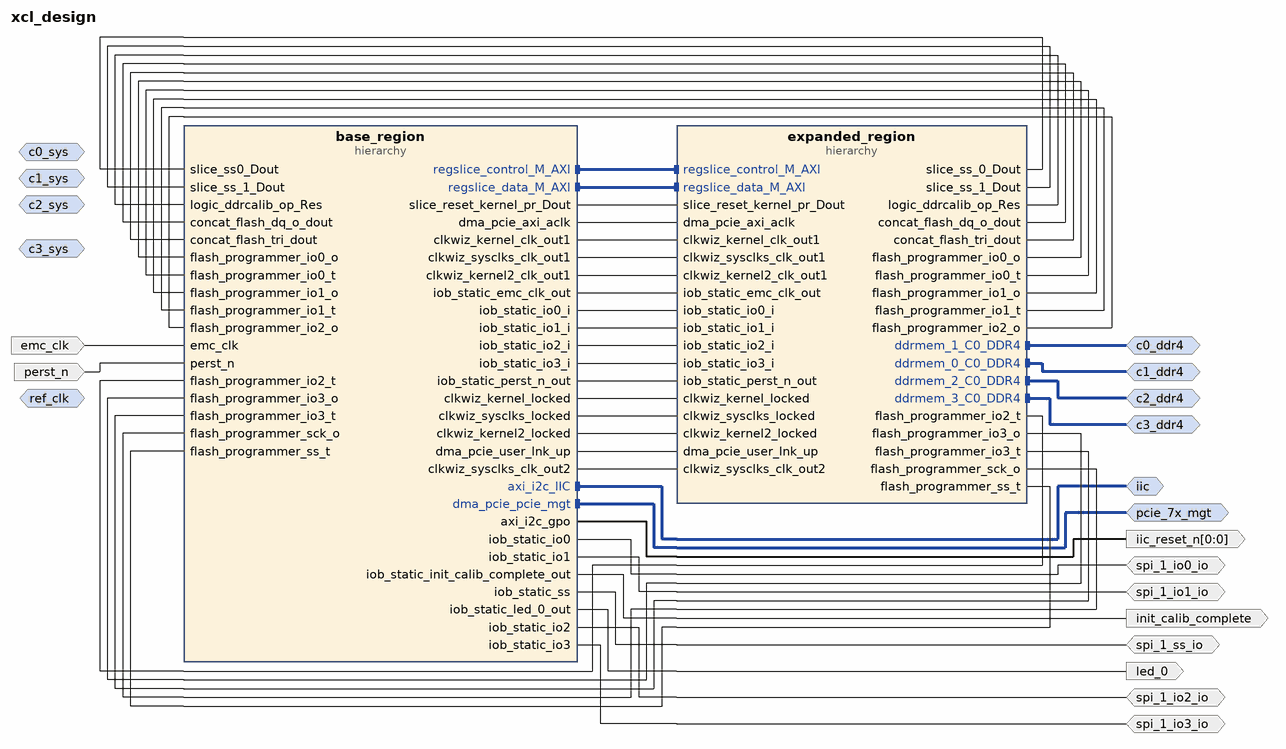
[diagram p0: block diagram of the top level]
# Vivado block design xcl_design, xcku115-flvb2104-2-e, Vivado 2017.1
create_bd_design xcl_design

create_bd_intf_port -mode Master -vlnv xilinx.com:interface:ddr4_rtl:1.0 c0_ddr4
create_bd_intf_port -mode Master -vlnv xilinx.com:interface:ddr4_rtl:1.0 c1_ddr4
create_bd_intf_port -mode Master -vlnv xilinx.com:interface:ddr4_rtl:1.0 c2_ddr4
create_bd_intf_port -mode Master -vlnv xilinx.com:interface:ddr4_rtl:1.0 c3_ddr4
create_bd_intf_port -mode Master -vlnv xilinx.com:interface:iic_rtl:1.0 iic
create_bd_intf_port -mode Master -vlnv xilinx.com:interface:pcie_7x_mgt_rtl:1.0 pcie_7x_mgt
create_bd_intf_port -mode Slave -vlnv xilinx.com:interface:diff_clock_rtl:1.0 c0_sys
set_property -dict {CONFIG.FREQ_HZ 300000000} [get_bd_intf_ports c0_sys]
create_bd_intf_port -mode Slave -vlnv xilinx.com:interface:diff_clock_rtl:1.0 c1_sys
set_property -dict {CONFIG.FREQ_HZ 300000000} [get_bd_intf_ports c1_sys]
create_bd_intf_port -mode Slave -vlnv xilinx.com:interface:diff_clock_rtl:1.0 c2_sys
set_property -dict {CONFIG.FREQ_HZ 300000000} [get_bd_intf_ports c2_sys]
create_bd_intf_port -mode Slave -vlnv xilinx.com:interface:diff_clock_rtl:1.0 c3_sys
set_property -dict {CONFIG.FREQ_HZ 300000000} [get_bd_intf_ports c3_sys]
create_bd_intf_port -mode Slave -vlnv xilinx.com:interface:diff_clock_rtl:1.0 ref_clk
set_property -dict {CONFIG.FREQ_HZ 100000000} [get_bd_intf_ports ref_clk]
create_bd_port -dir IO spi_1_ss_io
create_bd_port -dir IO spi_1_io0_io
create_bd_port -dir IO spi_1_io1_io
create_bd_port -dir IO spi_1_io2_io
create_bd_port -dir IO spi_1_io3_io
create_bd_port -dir O -from 0 -to 0 iic_reset_n
create_bd_port -dir O init_calib_complete
create_bd_port -dir O led_0
create_bd_port -dir I -type clk emc_clk
set_property -dict {CONFIG.FREQ_HZ 90000000} [get_bd_ports emc_clk]
create_bd_port -dir I -type rst perst_n
set_property -dict {CONFIG.POLARITY ACTIVE_LOW} [get_bd_ports perst_n]

create_bd_cell -type hier base_region
create_bd_cell -type hier expanded_region

# ---- hierarchy /base_region ----
current_bd_instance /base_region
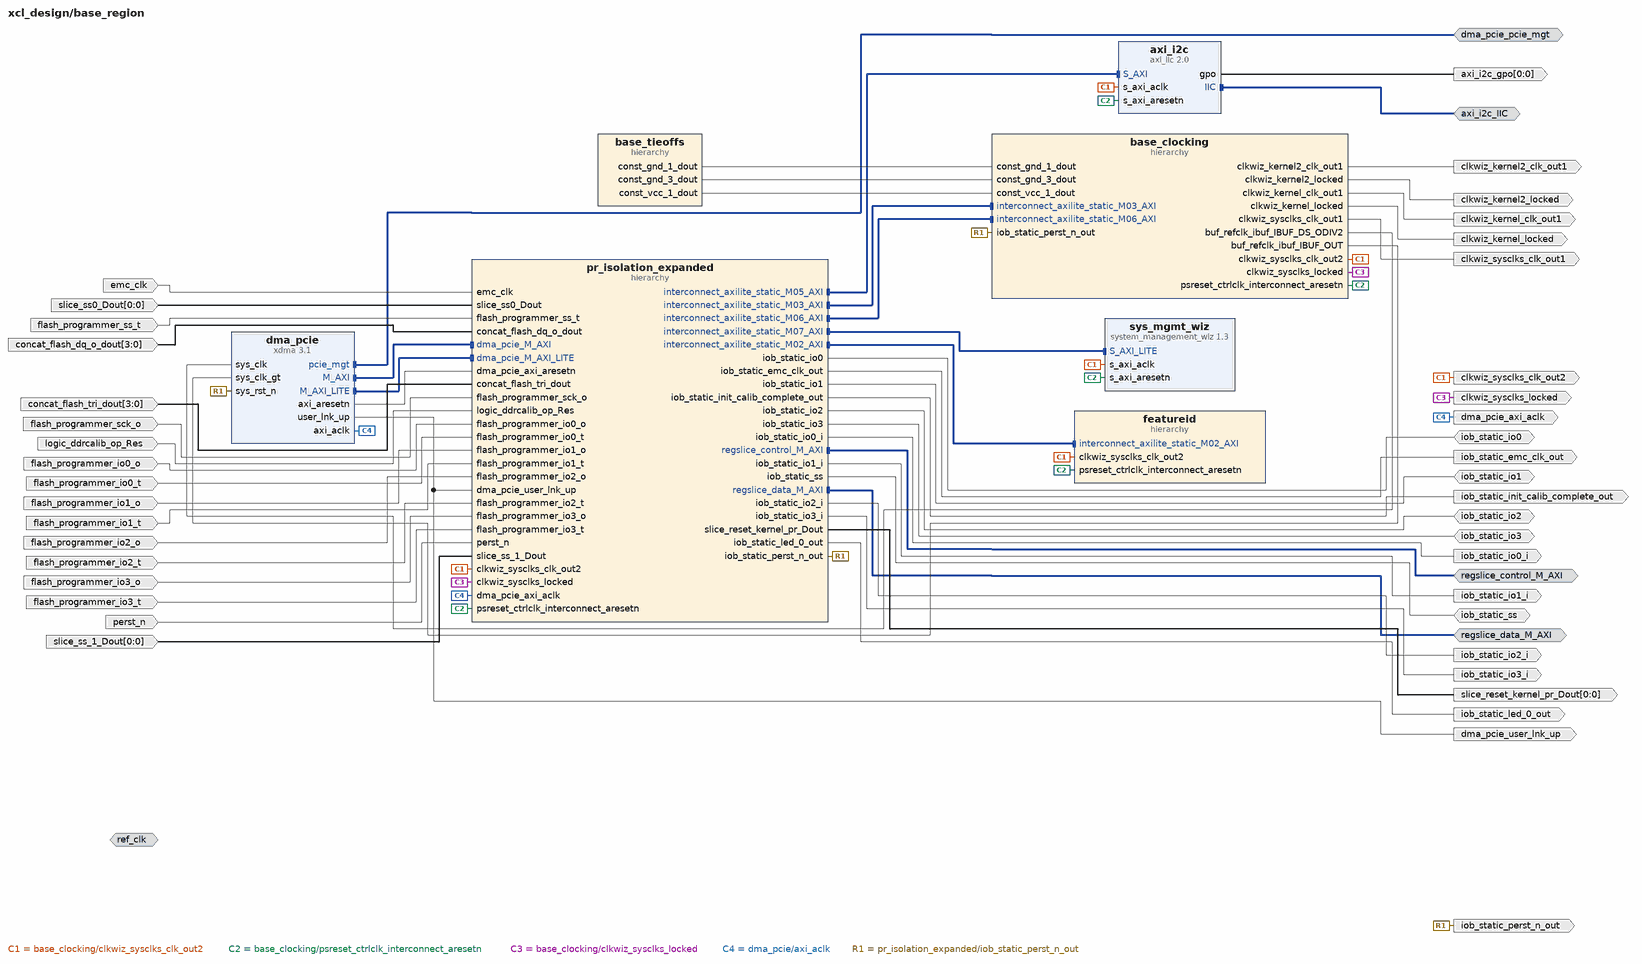
[diagram p1: block diagram inside /base_region]
create_bd_intf_pin -mode Master -vlnv xilinx.com:interface:iic_rtl:1.0 axi_i2c_IIC
create_bd_intf_pin -mode Master -vlnv xilinx.com:interface:pcie_7x_mgt_rtl:1.0 dma_pcie_pcie_mgt
create_bd_intf_pin -mode Slave -vlnv xilinx.com:interface:diff_clock_rtl:1.0 ref_clk
create_bd_intf_pin -mode Master -vlnv xilinx.com:interface:aximm_rtl:1.0 regslice_control_M_AXI
create_bd_intf_pin -mode Master -vlnv xilinx.com:interface:aximm_rtl:1.0 regslice_data_M_AXI
create_bd_pin -dir O -from 0 -to 0 axi_i2c_gpo
create_bd_pin -dir O -type clk clkwiz_kernel2_clk_out1
create_bd_pin -dir O clkwiz_kernel2_locked
create_bd_pin -dir O -type clk clkwiz_kernel_clk_out1
create_bd_pin -dir O clkwiz_kernel_locked
create_bd_pin -dir O -type clk clkwiz_sysclks_clk_out1
create_bd_pin -dir O -type clk clkwiz_sysclks_clk_out2
create_bd_pin -dir O clkwiz_sysclks_locked
create_bd_pin -dir I -from 3 -to 0 concat_flash_dq_o_dout
create_bd_pin -dir I -from 3 -to 0 concat_flash_tri_dout
create_bd_pin -dir O -type clk dma_pcie_axi_aclk
create_bd_pin -dir O dma_pcie_user_lnk_up
create_bd_pin -dir I emc_clk
create_bd_pin -dir I flash_programmer_io0_o
create_bd_pin -dir I flash_programmer_io0_t
create_bd_pin -dir I flash_programmer_io1_o
create_bd_pin -dir I flash_programmer_io1_t
create_bd_pin -dir I flash_programmer_io2_o
create_bd_pin -dir I flash_programmer_io2_t
create_bd_pin -dir I flash_programmer_io3_o
create_bd_pin -dir I flash_programmer_io3_t
create_bd_pin -dir I -type clk flash_programmer_sck_o
create_bd_pin -dir I flash_programmer_ss_t
create_bd_pin -dir O iob_static_emc_clk_out
create_bd_pin -dir O iob_static_init_calib_complete_out
create_bd_pin -dir IO iob_static_io0
create_bd_pin -dir O iob_static_io0_i
create_bd_pin -dir IO iob_static_io1
create_bd_pin -dir O iob_static_io1_i
create_bd_pin -dir IO iob_static_io2
create_bd_pin -dir O iob_static_io2_i
create_bd_pin -dir IO iob_static_io3
create_bd_pin -dir O iob_static_io3_i
create_bd_pin -dir O iob_static_led_0_out
create_bd_pin -dir O iob_static_perst_n_out
create_bd_pin -dir IO iob_static_ss
create_bd_pin -dir I logic_ddrcalib_op_Res
create_bd_pin -dir I perst_n
create_bd_pin -dir O -from 0 -to 0 slice_reset_kernel_pr_Dout
create_bd_pin -dir I -from 0 -to 0 slice_ss0_Dout
create_bd_pin -dir I -from 0 -to 0 slice_ss_1_Dout

create_bd_cell -type ip -vlnv xilinx.com:ip:axi_iic:2.0 axi_i2c
set_property -dict {CONFIG.C_DEFAULT_VALUE 0x01} [get_bd_cells axi_i2c]
create_bd_cell -type hier base_clocking
create_bd_cell -type hier base_tieoffs
create_bd_cell -type ip -vlnv xilinx.com:ip:xdma:3.1 dma_pcie
set_property -dict [list \
  CONFIG.mode_selection Advanced \
  CONFIG.pl_link_cap_max_link_width X8 \
  CONFIG.pl_link_cap_max_link_speed 8.0_GT/s \
  CONFIG.axi_data_width 256_bit \
  CONFIG.axisten_freq 250 \
  CONFIG.mcap_enablement PR_over_PCIe \
  CONFIG.pf0_device_id 8238 \
  CONFIG.pf0_subsystem_id 4432 \
  CONFIG.axilite_master_en true \
  CONFIG.axilite_master_size 4 \
  CONFIG.xdma_rnum_chnl 2 \
  CONFIG.xdma_wnum_chnl 2 \
  CONFIG.xdma_num_usr_irq 16 \
  CONFIG.cfg_mgmt_if false \
  CONFIG.axi_id_width 2 \
] [get_bd_cells dma_pcie]
create_bd_cell -type hier featureid
create_bd_cell -type hier pr_isolation_expanded
create_bd_cell -type ip -vlnv xilinx.com:ip:system_management_wiz:1.3 sys_mgmt_wiz
set_property -dict [list \
  CONFIG.DCLK_FREQUENCY 50 \
  CONFIG.OT_ALARM false \
  CONFIG.USER_TEMP_ALARM false \
  CONFIG.VCCINT_ALARM false \
  CONFIG.VCCAUX_ALARM false \
  CONFIG.CHANNEL_ENABLE_VP_VN false \
  CONFIG.AVERAGE_ENABLE_VBRAM true \
  CONFIG.AVERAGE_ENABLE_TEMPERATURE true \
  CONFIG.AVERAGE_ENABLE_VCCINT true \
  CONFIG.AVERAGE_ENABLE_VCCAUX true \
] [get_bd_cells sys_mgmt_wiz]

# ---- hierarchy /base_region/base_clocking ----
current_bd_instance /base_region/base_clocking
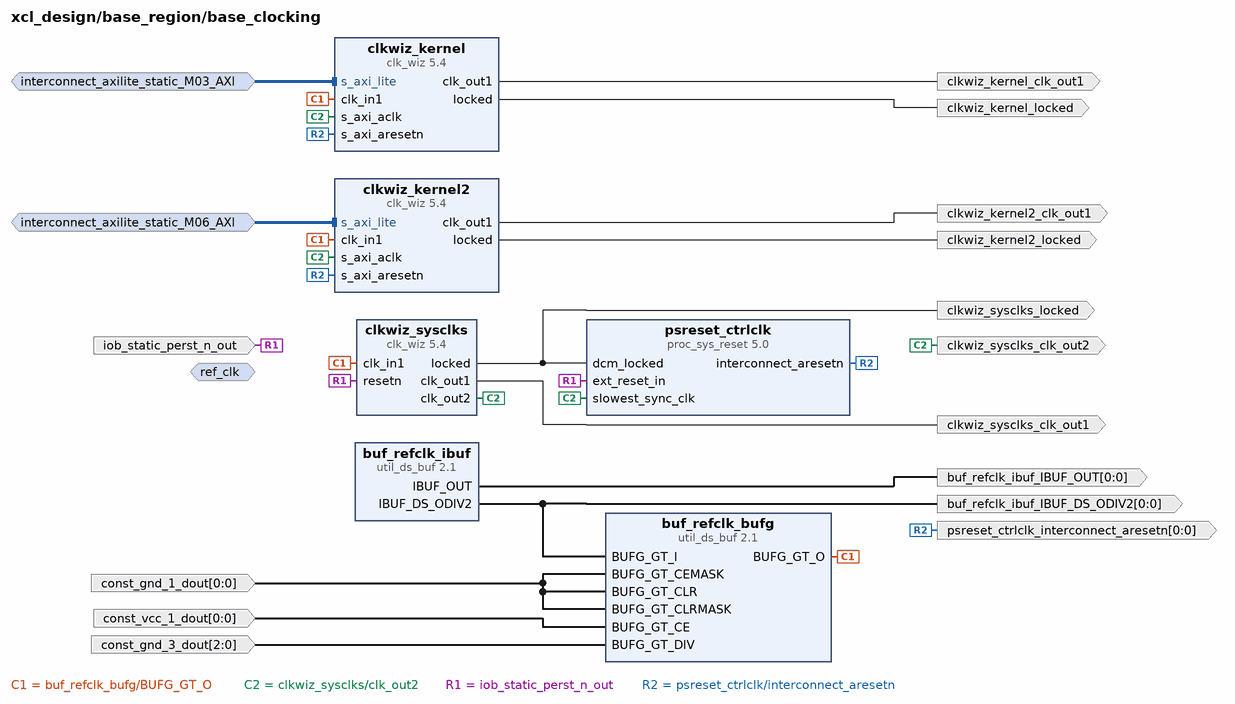
[diagram p2: block diagram inside /base_region/base_clocking]
create_bd_intf_pin -mode Slave -vlnv xilinx.com:interface:aximm_rtl:1.0 interconnect_axilite_static_M03_AXI
create_bd_intf_pin -mode Slave -vlnv xilinx.com:interface:aximm_rtl:1.0 interconnect_axilite_static_M06_AXI
create_bd_intf_pin -mode Slave -vlnv xilinx.com:interface:diff_clock_rtl:1.0 ref_clk
create_bd_pin -dir O -from 0 -to 0 -type clk buf_refclk_ibuf_IBUF_DS_ODIV2
create_bd_pin -dir O -from 0 -to 0 -type clk buf_refclk_ibuf_IBUF_OUT
create_bd_pin -dir O -type clk clkwiz_kernel2_clk_out1
create_bd_pin -dir O clkwiz_kernel2_locked
create_bd_pin -dir O -type clk clkwiz_kernel_clk_out1
create_bd_pin -dir O clkwiz_kernel_locked
create_bd_pin -dir O -type clk clkwiz_sysclks_clk_out1
create_bd_pin -dir O -type clk clkwiz_sysclks_clk_out2
create_bd_pin -dir O clkwiz_sysclks_locked
create_bd_pin -dir I -from 0 -to 0 const_gnd_1_dout
create_bd_pin -dir I -from 2 -to 0 const_gnd_3_dout
create_bd_pin -dir I -from 0 -to 0 const_vcc_1_dout
create_bd_pin -dir I -type rst iob_static_perst_n_out
create_bd_pin -dir O -from 0 -to 0 -type rst psreset_ctrlclk_interconnect_aresetn

create_bd_cell -type ip -vlnv xilinx.com:ip:util_ds_buf:2.1 buf_refclk_bufg
set_property -dict {CONFIG.C_BUF_TYPE BUFG_GT} [get_bd_cells buf_refclk_bufg]
create_bd_cell -type ip -vlnv xilinx.com:ip:util_ds_buf:2.1 buf_refclk_ibuf
set_property -dict {CONFIG.C_BUF_TYPE IBUFDSGTE} [get_bd_cells buf_refclk_ibuf]
create_bd_cell -type ip -vlnv xilinx.com:ip:clk_wiz:5.4 clkwiz_kernel
set_property -dict {CONFIG.USE_DYN_RECONFIG true CONFIG.CLKOUT1_REQUESTED_OUT_FREQ 300.000} [get_bd_cells clkwiz_kernel]
create_bd_cell -type ip -vlnv xilinx.com:ip:clk_wiz:5.4 clkwiz_kernel2
set_property -dict [list \
  CONFIG.USE_DYN_RECONFIG true \
  CONFIG.CLKOUT1_REQUESTED_OUT_FREQ 500.000 \
  CONFIG.MMCM_DIVCLK_DIVIDE 1 \
  CONFIG.MMCM_CLKOUT0_DIVIDE_F 2.000 \
  CONFIG.CLKOUT1_JITTER 97.082 \
] [get_bd_cells clkwiz_kernel2]
create_bd_cell -type ip -vlnv xilinx.com:ip:clk_wiz:5.4 clkwiz_sysclks
set_property -dict [list \
  CONFIG.PRIMITIVE PLL \
  CONFIG.USE_PHASE_ALIGNMENT false \
  CONFIG.SECONDARY_SOURCE Single_ended_clock_capable_pin \
  CONFIG.CLKOUT2_USED true \
  CONFIG.NUM_OUT_CLKS 2 \
  CONFIG.CLKOUT1_REQUESTED_OUT_FREQ 300.000 \
  CONFIG.CLKOUT2_REQUESTED_OUT_FREQ 50.000 \
  CONFIG.PRIM_SOURCE Single_ended_clock_capable_pin \
  CONFIG.CLKOUT1_DRIVES Buffer \
  CONFIG.CLKOUT2_DRIVES Buffer \
  CONFIG.CLKOUT3_DRIVES Buffer \
  CONFIG.CLKOUT4_DRIVES Buffer \
  CONFIG.CLKOUT5_DRIVES Buffer \
  CONFIG.CLKOUT6_DRIVES Buffer \
  CONFIG.CLKOUT7_DRIVES Buffer \
  CONFIG.RESET_PORT resetn \
  CONFIG.MMCM_DIVCLK_DIVIDE 1 \
  CONFIG.MMCM_CLKFBOUT_MULT_F 6 \
  CONFIG.MMCM_COMPENSATION AUTO \
  CONFIG.MMCM_CLKOUT0_DIVIDE_F 2 \
  CONFIG.MMCM_CLKOUT1_DIVIDE 12 \
  CONFIG.RESET_TYPE ACTIVE_LOW \
  CONFIG.CLKOUT1_JITTER 122.522 \
  CONFIG.CLKOUT1_PHASE_ERROR 132.063 \
  CONFIG.CLKOUT2_JITTER 174.353 \
  CONFIG.CLKOUT2_PHASE_ERROR 132.063 \
] [get_bd_cells clkwiz_sysclks]
create_bd_cell -type ip -vlnv xilinx.com:ip:proc_sys_reset:5.0 psreset_ctrlclk
set_property -dict {CONFIG.C_AUX_RST_WIDTH 1 CONFIG.C_EXT_RST_WIDTH 1} [get_bd_cells psreset_ctrlclk]

# ---- hierarchy /base_region/base_tieoffs ----
current_bd_instance /base_region/base_tieoffs
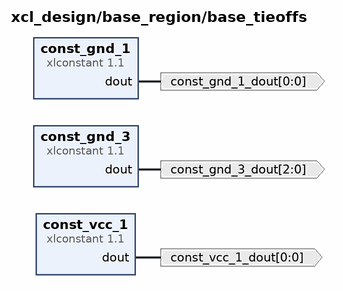
[diagram p3: block diagram inside /base_region/base_tieoffs]
create_bd_pin -dir O -from 0 -to 0 const_gnd_1_dout
create_bd_pin -dir O -from 2 -to 0 const_gnd_3_dout
create_bd_pin -dir O -from 0 -to 0 const_vcc_1_dout

create_bd_cell -type ip -vlnv xilinx.com:ip:xlconstant:1.1 const_gnd_1
set_property -dict {CONFIG.CONST_VAL 0} [get_bd_cells const_gnd_1]
create_bd_cell -type ip -vlnv xilinx.com:ip:xlconstant:1.1 const_gnd_3
set_property -dict {CONFIG.CONST_WIDTH 3 CONFIG.CONST_VAL 0} [get_bd_cells const_gnd_3]
create_bd_cell -type ip -vlnv xilinx.com:ip:xlconstant:1.1 const_vcc_1

# ---- hierarchy /base_region/featureid ----
current_bd_instance /base_region/featureid
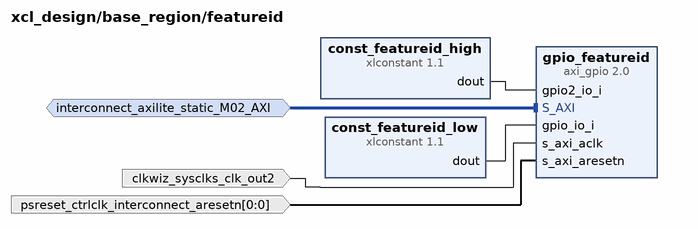
[diagram p4: block diagram inside /base_region/featureid]
create_bd_intf_pin -mode Slave -vlnv xilinx.com:interface:aximm_rtl:1.0 interconnect_axilite_static_M02_AXI
create_bd_pin -dir I -type clk clkwiz_sysclks_clk_out2
create_bd_pin -dir I -from 0 -to 0 -type rst psreset_ctrlclk_interconnect_aresetn

create_bd_cell -type ip -vlnv xilinx.com:ip:xlconstant:1.1 const_featureid_high
set_property -dict {CONFIG.CONST_WIDTH 32 CONFIG.CONST_VAL 0} [get_bd_cells const_featureid_high]
create_bd_cell -type ip -vlnv xilinx.com:ip:xlconstant:1.1 const_featureid_low
set_property -dict {CONFIG.CONST_WIDTH 32 CONFIG.CONST_VAL 0} [get_bd_cells const_featureid_low]
create_bd_cell -type ip -vlnv xilinx.com:ip:axi_gpio:2.0 gpio_featureid
set_property -dict {CONFIG.C_IS_DUAL 1 CONFIG.C_ALL_INPUTS 1 CONFIG.C_ALL_INPUTS_2 1} [get_bd_cells gpio_featureid]

# ---- hierarchy /base_region/pr_isolation_expanded ----
current_bd_instance /base_region/pr_isolation_expanded
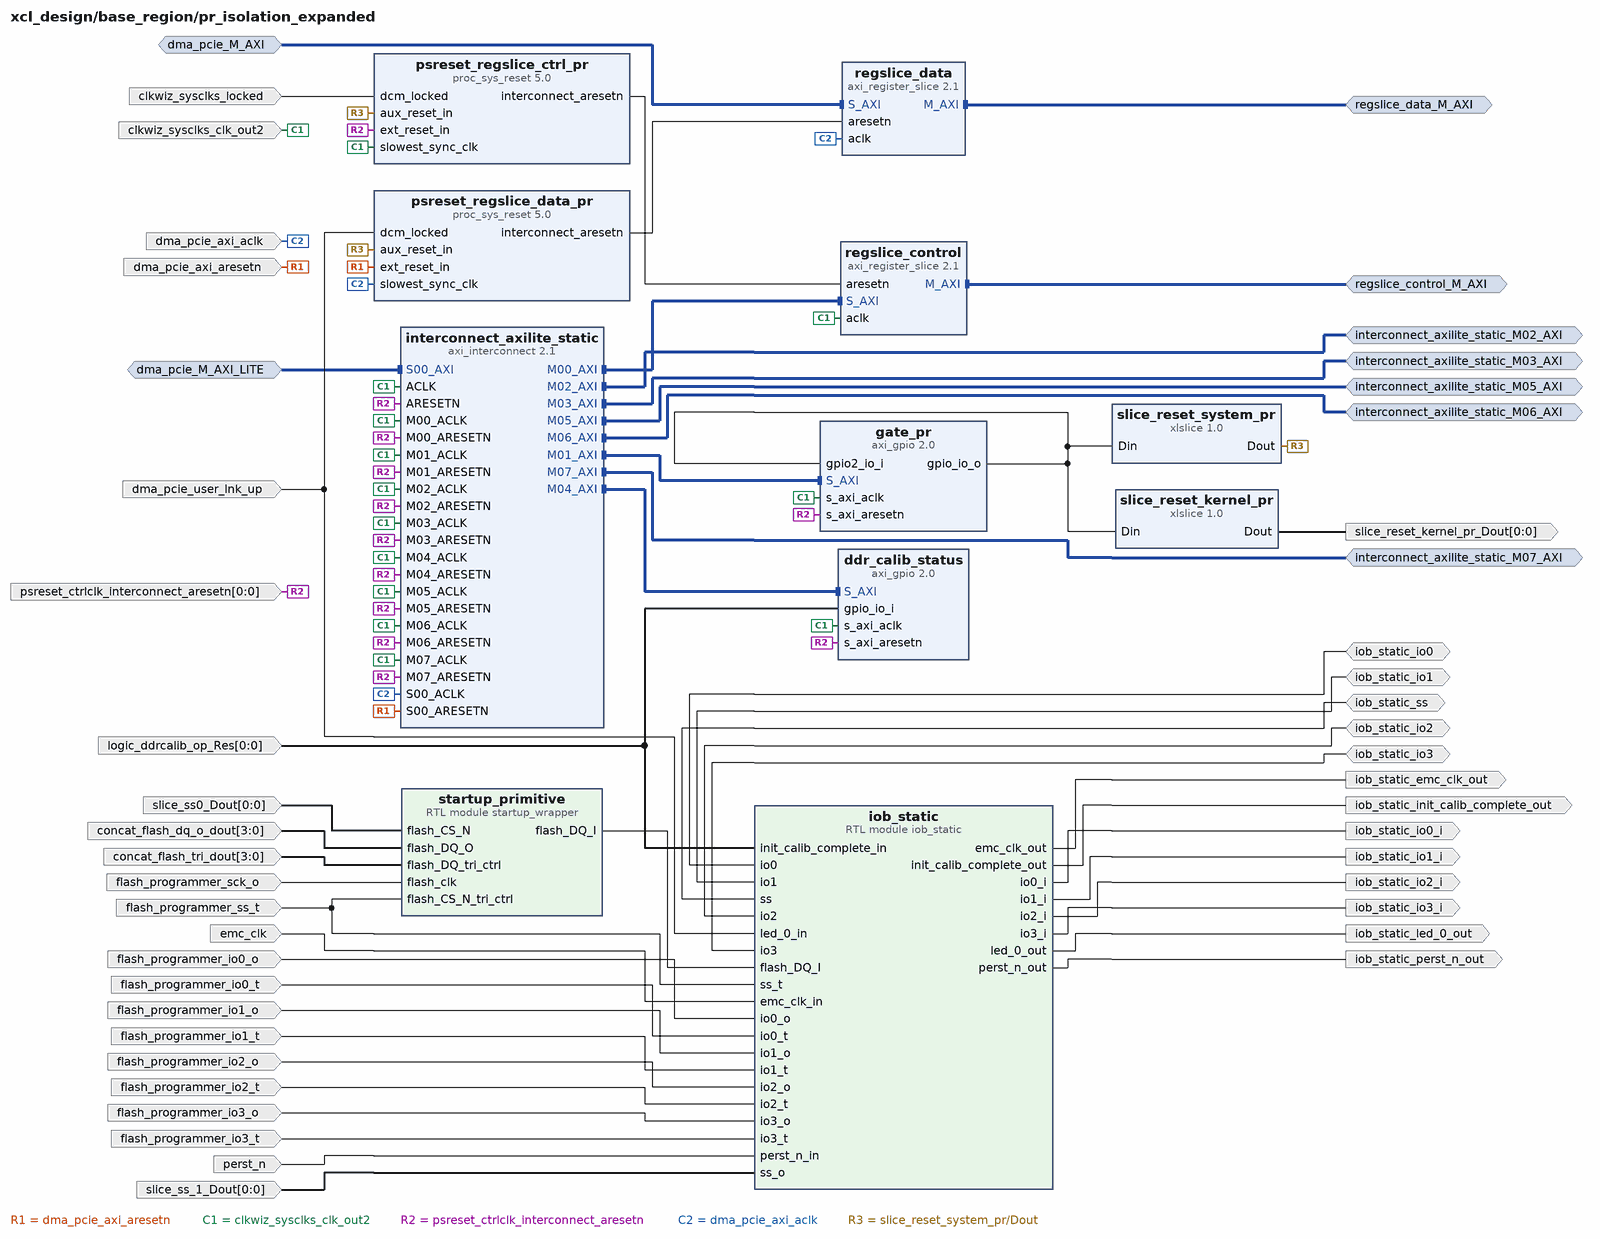
[diagram p5: block diagram inside /base_region/pr_isolation_expanded]
create_bd_intf_pin -mode Slave -vlnv xilinx.com:interface:aximm_rtl:1.0 dma_pcie_M_AXI
create_bd_intf_pin -mode Slave -vlnv xilinx.com:interface:aximm_rtl:1.0 dma_pcie_M_AXI_LITE
create_bd_intf_pin -mode Master -vlnv xilinx.com:interface:aximm_rtl:1.0 interconnect_axilite_static_M02_AXI
create_bd_intf_pin -mode Master -vlnv xilinx.com:interface:aximm_rtl:1.0 interconnect_axilite_static_M03_AXI
create_bd_intf_pin -mode Master -vlnv xilinx.com:interface:aximm_rtl:1.0 interconnect_axilite_static_M05_AXI
create_bd_intf_pin -mode Master -vlnv xilinx.com:interface:aximm_rtl:1.0 interconnect_axilite_static_M06_AXI
create_bd_intf_pin -mode Master -vlnv xilinx.com:interface:aximm_rtl:1.0 interconnect_axilite_static_M07_AXI
create_bd_intf_pin -mode Master -vlnv xilinx.com:interface:aximm_rtl:1.0 regslice_control_M_AXI
create_bd_intf_pin -mode Master -vlnv xilinx.com:interface:aximm_rtl:1.0 regslice_data_M_AXI
create_bd_pin -dir I -type clk clkwiz_sysclks_clk_out2
create_bd_pin -dir I clkwiz_sysclks_locked
create_bd_pin -dir I -from 3 -to 0 concat_flash_dq_o_dout
create_bd_pin -dir I -from 3 -to 0 concat_flash_tri_dout
create_bd_pin -dir I -type clk dma_pcie_axi_aclk
create_bd_pin -dir I -type rst dma_pcie_axi_aresetn
create_bd_pin -dir I dma_pcie_user_lnk_up
create_bd_pin -dir I emc_clk
create_bd_pin -dir I flash_programmer_io0_o
create_bd_pin -dir I flash_programmer_io0_t
create_bd_pin -dir I flash_programmer_io1_o
create_bd_pin -dir I flash_programmer_io1_t
create_bd_pin -dir I flash_programmer_io2_o
create_bd_pin -dir I flash_programmer_io2_t
create_bd_pin -dir I flash_programmer_io3_o
create_bd_pin -dir I flash_programmer_io3_t
create_bd_pin -dir I -type clk flash_programmer_sck_o
create_bd_pin -dir I flash_programmer_ss_t
create_bd_pin -dir O iob_static_emc_clk_out
create_bd_pin -dir O iob_static_init_calib_complete_out
create_bd_pin -dir IO iob_static_io0
create_bd_pin -dir O iob_static_io0_i
create_bd_pin -dir IO iob_static_io1
create_bd_pin -dir O iob_static_io1_i
create_bd_pin -dir IO iob_static_io2
create_bd_pin -dir O iob_static_io2_i
create_bd_pin -dir IO iob_static_io3
create_bd_pin -dir O iob_static_io3_i
create_bd_pin -dir O iob_static_led_0_out
create_bd_pin -dir O iob_static_perst_n_out
create_bd_pin -dir IO iob_static_ss
create_bd_pin -dir I -from 0 -to 0 logic_ddrcalib_op_Res
create_bd_pin -dir I perst_n
create_bd_pin -dir I -from 0 -to 0 -type rst psreset_ctrlclk_interconnect_aresetn
create_bd_pin -dir O -from 0 -to 0 slice_reset_kernel_pr_Dout
create_bd_pin -dir I -from 0 -to 0 slice_ss0_Dout
create_bd_pin -dir I -from 0 -to 0 slice_ss_1_Dout

create_bd_cell -type ip -vlnv xilinx.com:ip:axi_gpio:2.0 ddr_calib_status
set_property -dict {CONFIG.C_GPIO_WIDTH 1 CONFIG.C_ALL_INPUTS 1} [get_bd_cells ddr_calib_status]
create_bd_cell -type ip -vlnv xilinx.com:ip:axi_gpio:2.0 gate_pr
set_property -dict [list \
  CONFIG.C_GPIO_WIDTH 2 \
  CONFIG.C_GPIO2_WIDTH 2 \
  CONFIG.C_IS_DUAL 1 \
  CONFIG.C_DOUT_DEFAULT 0xFFFFFFFF \
  CONFIG.C_ALL_INPUTS_2 1 \
  CONFIG.C_ALL_OUTPUTS 1 \
] [get_bd_cells gate_pr]
create_bd_cell -type ip -vlnv xilinx.com:ip:axi_interconnect:2.1 interconnect_axilite_static
set_property -dict {CONFIG.NUM_MI 8 CONFIG.S00_HAS_REGSLICE 4} [get_bd_cells interconnect_axilite_static]
create_bd_cell -type module -reference iob_static iob_static
create_bd_cell -type ip -vlnv xilinx.com:ip:proc_sys_reset:5.0 psreset_regslice_ctrl_pr
set_property -dict {CONFIG.C_AUX_RST_WIDTH 1 CONFIG.C_EXT_RST_WIDTH 1} [get_bd_cells psreset_regslice_ctrl_pr]
create_bd_cell -type ip -vlnv xilinx.com:ip:proc_sys_reset:5.0 psreset_regslice_data_pr
set_property -dict {CONFIG.C_AUX_RST_WIDTH 1 CONFIG.C_EXT_RST_WIDTH 1} [get_bd_cells psreset_regslice_data_pr]
create_bd_cell -type ip -vlnv xilinx.com:ip:axi_register_slice:2.1 regslice_control
create_bd_cell -type ip -vlnv xilinx.com:ip:axi_register_slice:2.1 regslice_data
set_property -dict [list \
  CONFIG.PROTOCOL AXI4 \
  CONFIG.READ_WRITE_MODE READ_WRITE \
  CONFIG.ADDR_WIDTH 38 \
  CONFIG.DATA_WIDTH 256 \
  CONFIG.ID_WIDTH 4 \
] [get_bd_cells regslice_data]
create_bd_cell -type ip -vlnv xilinx.com:ip:xlslice:1.0 slice_reset_kernel_pr
set_property -dict {CONFIG.DIN_TO 1 CONFIG.DIN_FROM 1 CONFIG.DIN_WIDTH 2} [get_bd_cells slice_reset_kernel_pr]
create_bd_cell -type ip -vlnv xilinx.com:ip:xlslice:1.0 slice_reset_system_pr
set_property -dict {CONFIG.DIN_TO 0 CONFIG.DIN_FROM 0 CONFIG.DIN_WIDTH 2} [get_bd_cells slice_reset_system_pr]
create_bd_cell -type module -reference startup_wrapper startup_primitive

# ---- hierarchy /expanded_region ----
current_bd_instance /expanded_region
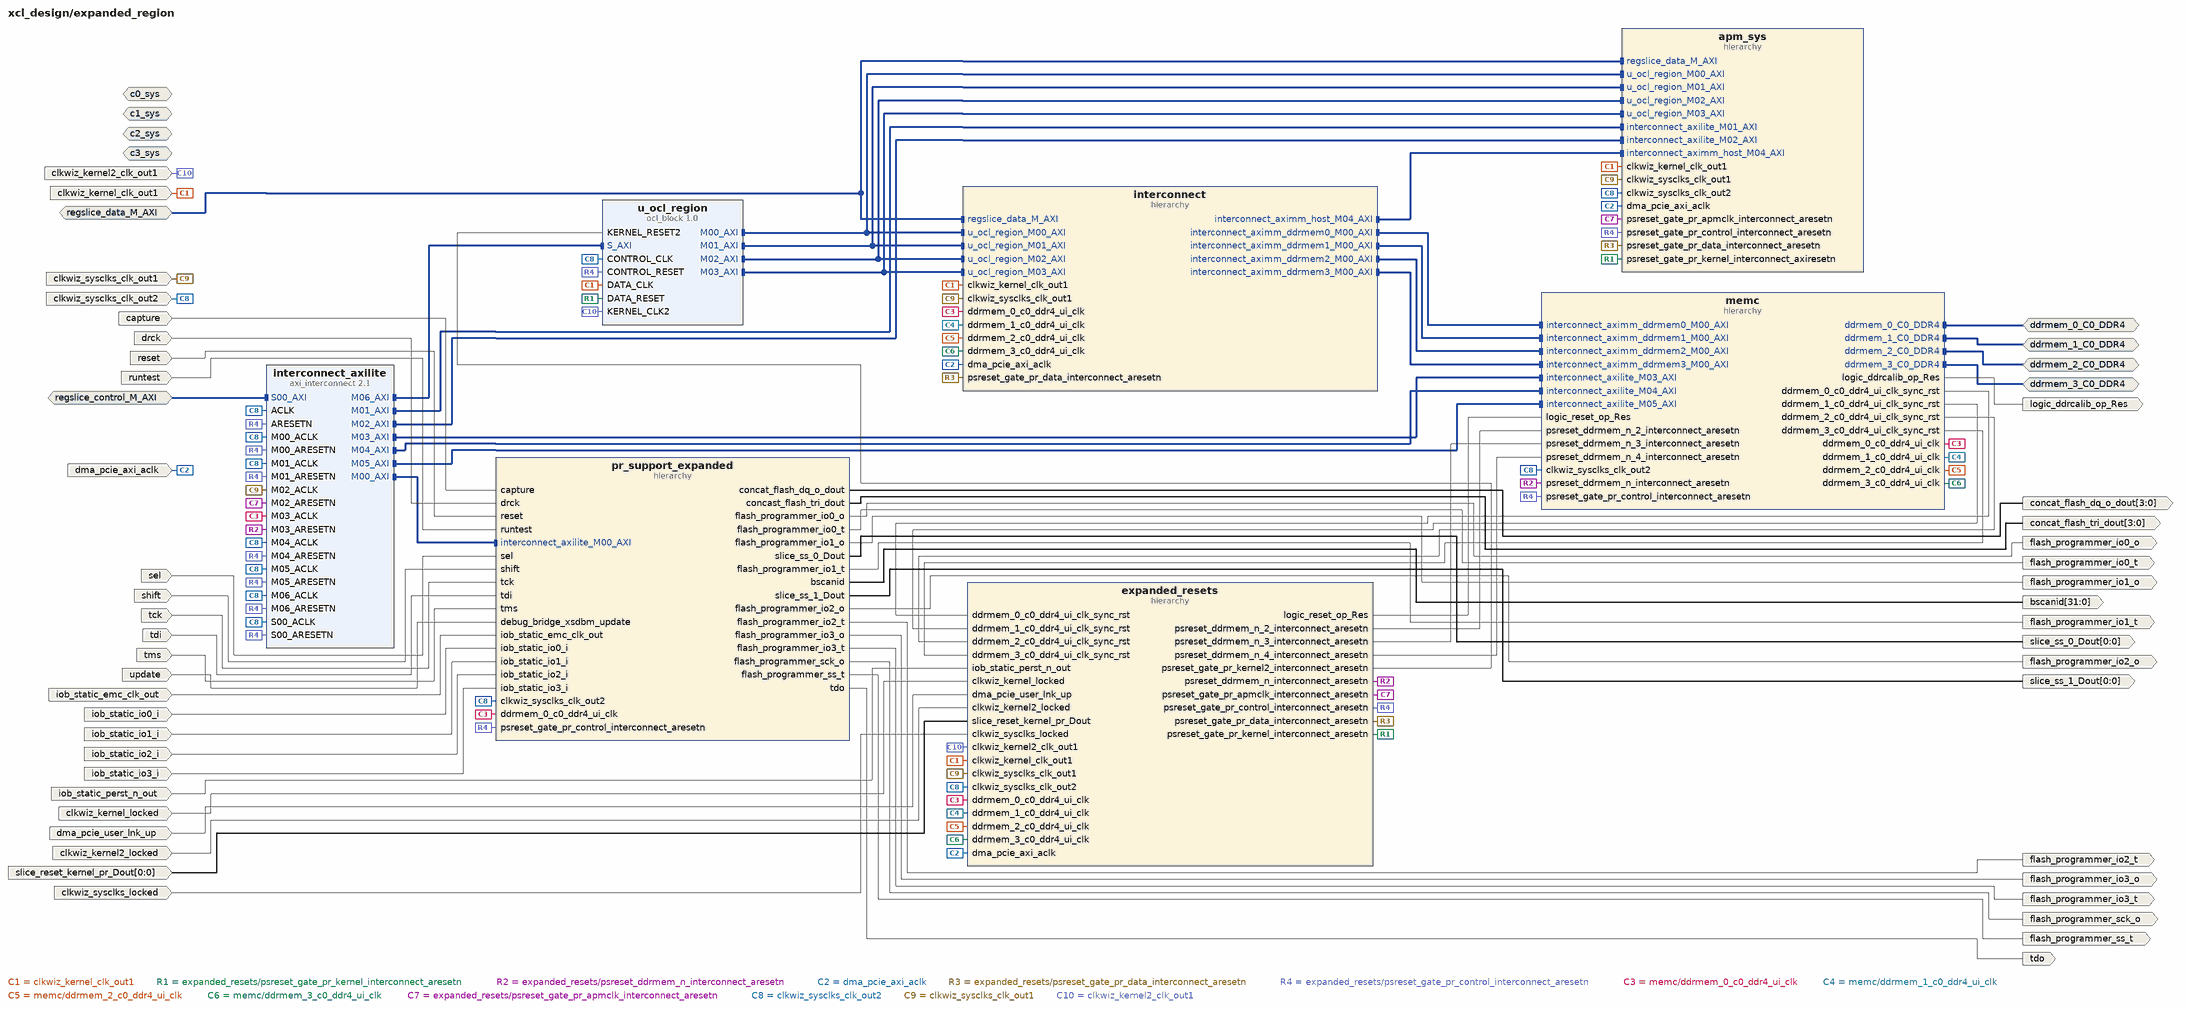
[diagram p6: block diagram inside /expanded_region]
create_bd_intf_pin -mode Slave -vlnv xilinx.com:interface:diff_clock_rtl:1.0 c0_sys
create_bd_intf_pin -mode Slave -vlnv xilinx.com:interface:diff_clock_rtl:1.0 c1_sys
create_bd_intf_pin -mode Slave -vlnv xilinx.com:interface:diff_clock_rtl:1.0 c2_sys
create_bd_intf_pin -mode Slave -vlnv xilinx.com:interface:diff_clock_rtl:1.0 c3_sys
create_bd_intf_pin -mode Master -vlnv xilinx.com:interface:ddr4_rtl:1.0 ddrmem_0_C0_DDR4
create_bd_intf_pin -mode Master -vlnv xilinx.com:interface:ddr4_rtl:1.0 ddrmem_1_C0_DDR4
create_bd_intf_pin -mode Master -vlnv xilinx.com:interface:ddr4_rtl:1.0 ddrmem_2_C0_DDR4
create_bd_intf_pin -mode Master -vlnv xilinx.com:interface:ddr4_rtl:1.0 ddrmem_3_C0_DDR4
create_bd_intf_pin -mode Slave -vlnv xilinx.com:interface:aximm_rtl:1.0 regslice_control_M_AXI
create_bd_intf_pin -mode Slave -vlnv xilinx.com:interface:aximm_rtl:1.0 regslice_data_M_AXI
create_bd_pin -dir O -from 31 -to 0 bscanid
create_bd_pin -dir I capture
create_bd_pin -dir I -type clk clkwiz_kernel2_clk_out1
create_bd_pin -dir I clkwiz_kernel2_locked
create_bd_pin -dir I -type clk clkwiz_kernel_clk_out1
create_bd_pin -dir I clkwiz_kernel_locked
create_bd_pin -dir I -type clk clkwiz_sysclks_clk_out1
create_bd_pin -dir I -type clk clkwiz_sysclks_clk_out2
create_bd_pin -dir I -type rst clkwiz_sysclks_locked
create_bd_pin -dir O -from 3 -to 0 concat_flash_dq_o_dout
create_bd_pin -dir O -from 3 -to 0 concat_flash_tri_dout
create_bd_pin -dir I -type clk dma_pcie_axi_aclk
create_bd_pin -dir I dma_pcie_user_lnk_up
create_bd_pin -dir I drck
create_bd_pin -dir O flash_programmer_io0_o
create_bd_pin -dir O flash_programmer_io0_t
create_bd_pin -dir O flash_programmer_io1_o
create_bd_pin -dir O flash_programmer_io1_t
create_bd_pin -dir O flash_programmer_io2_o
create_bd_pin -dir O flash_programmer_io2_t
create_bd_pin -dir O flash_programmer_io3_o
create_bd_pin -dir O flash_programmer_io3_t
create_bd_pin -dir O flash_programmer_sck_o
create_bd_pin -dir O flash_programmer_ss_t
create_bd_pin -dir I -type clk iob_static_emc_clk_out
create_bd_pin -dir I iob_static_io0_i
create_bd_pin -dir I iob_static_io1_i
create_bd_pin -dir I iob_static_io2_i
create_bd_pin -dir I iob_static_io3_i
create_bd_pin -dir I iob_static_perst_n_out
create_bd_pin -dir O logic_ddrcalib_op_Res
create_bd_pin -dir I reset
create_bd_pin -dir I runtest
create_bd_pin -dir I sel
create_bd_pin -dir I shift
create_bd_pin -dir I -from 0 -to 0 -type rst slice_reset_kernel_pr_Dout
create_bd_pin -dir O -from 0 -to 0 slice_ss_0_Dout
create_bd_pin -dir O -from 0 -to 0 slice_ss_1_Dout
create_bd_pin -dir I tck
create_bd_pin -dir I tdi
create_bd_pin -dir O tdo
create_bd_pin -dir I tms
create_bd_pin -dir I update

create_bd_cell -type hier apm_sys
create_bd_cell -type hier expanded_resets
create_bd_cell -type hier interconnect
create_bd_cell -type ip -vlnv xilinx.com:ip:axi_interconnect:2.1 interconnect_axilite
set_property -dict [list \
  CONFIG.NUM_MI 7 \
  CONFIG.M00_HAS_REGSLICE 4 \
  CONFIG.M01_HAS_REGSLICE 4 \
  CONFIG.M02_HAS_REGSLICE 4 \
  CONFIG.M03_HAS_REGSLICE 4 \
  CONFIG.M04_HAS_REGSLICE 4 \
  CONFIG.M05_HAS_REGSLICE 4 \
  CONFIG.M06_HAS_REGSLICE 4 \
  CONFIG.S00_HAS_REGSLICE 4 \
] [get_bd_cells interconnect_axilite]
create_bd_cell -type hier memc
create_bd_cell -type hier pr_support_expanded
create_bd_cell -type ip -vlnv xilinx.com:ip:ocl_block:1.0 u_ocl_region
set_property -dict [list \
  CONFIG.M_DATA_WIDTH 512 \
  CONFIG.M_ADDR_WIDTH 34 \
  CONFIG.M_ID_WIDTH 4 \
  CONFIG.S_ADDR_WIDTH 17 \
  CONFIG.USE_PR false \
  CONFIG.SYNC_RESET true \
  CONFIG.NUM_MI 4 \
  CONFIG.NUM_KERNELS 4 \
  CONFIG.KERNEL_TYPE ADD_ONE \
  CONFIG.HAS_KERNEL_CLOCK2 true \
  CONFIG.HAS_CONTROL_CLOCK true \
  CONFIG.HAS_S_MEM false \
  CONFIG.NUM_M_AXIS_RX 0 \
  CONFIG.NUM_S_AXIS_TX 0 \
  CONFIG.BOUNDARY_VERSION 2 \
  CONFIG.ENABLE_SMARTCONNECT false \
  CONFIG.M_HAS_REGSLICE 4 \
  CONFIG.S_HAS_REGSLICE 4 \
] [get_bd_cells u_ocl_region]

# ---- hierarchy /expanded_region/apm_sys ----
current_bd_instance /expanded_region/apm_sys
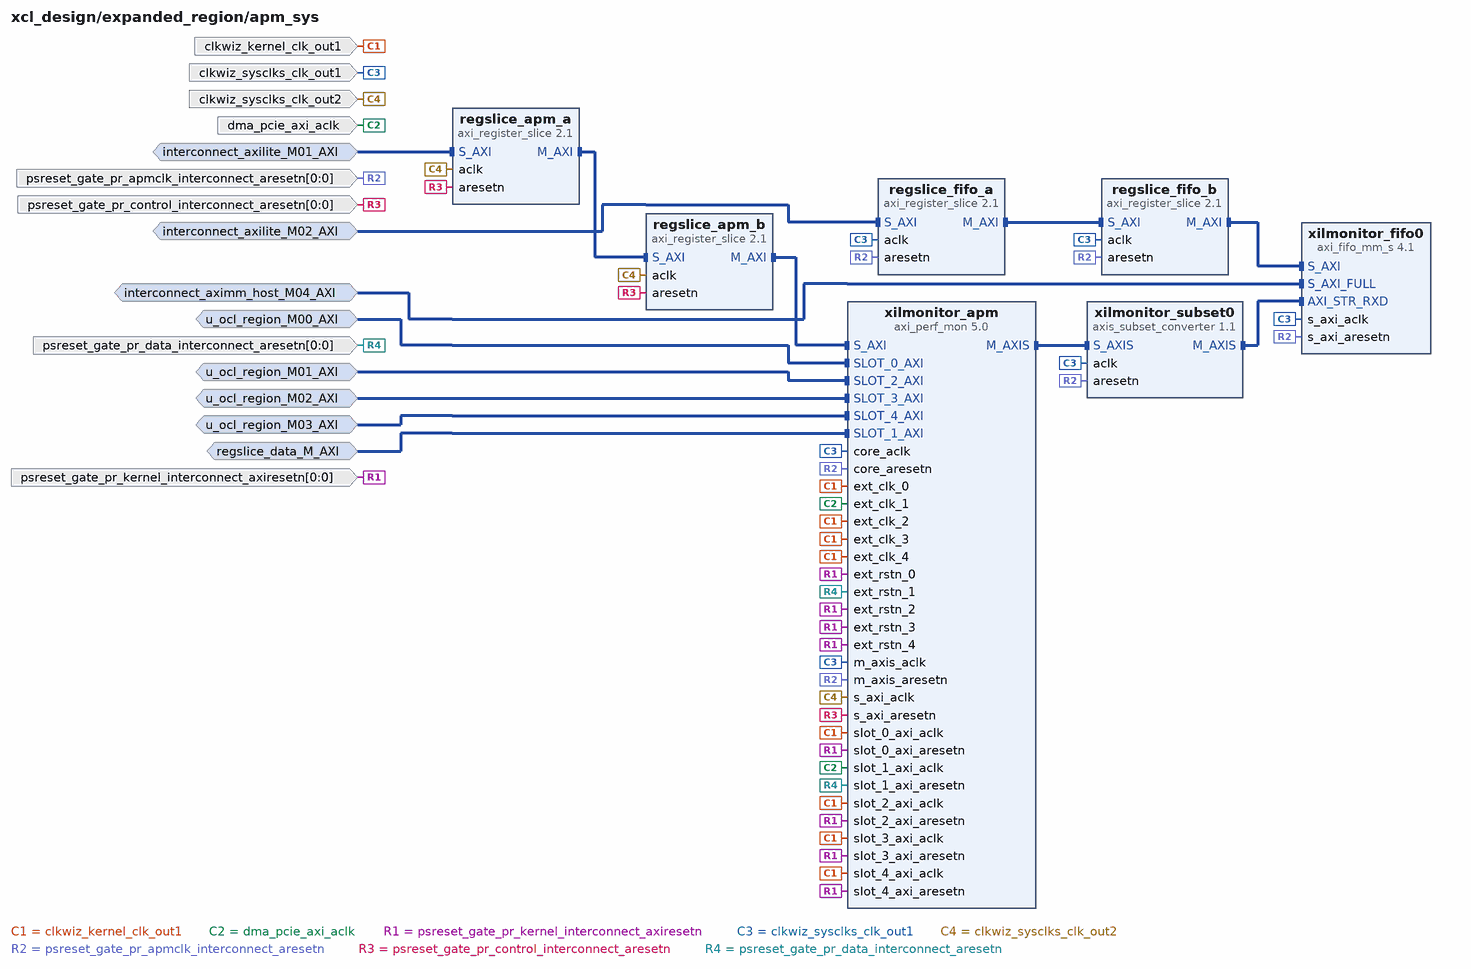
[diagram p7: block diagram inside /expanded_region/apm_sys]
create_bd_intf_pin -mode Slave -vlnv xilinx.com:interface:aximm_rtl:1.0 interconnect_axilite_M01_AXI
create_bd_intf_pin -mode Slave -vlnv xilinx.com:interface:aximm_rtl:1.0 interconnect_axilite_M02_AXI
create_bd_intf_pin -mode Slave -vlnv xilinx.com:interface:aximm_rtl:1.0 interconnect_aximm_host_M04_AXI
create_bd_intf_pin -mode Monitor -vlnv xilinx.com:interface:aximm_rtl:1.0 regslice_data_M_AXI
create_bd_intf_pin -mode Monitor -vlnv xilinx.com:interface:aximm_rtl:1.0 u_ocl_region_M00_AXI
create_bd_intf_pin -mode Monitor -vlnv xilinx.com:interface:aximm_rtl:1.0 u_ocl_region_M01_AXI
create_bd_intf_pin -mode Monitor -vlnv xilinx.com:interface:aximm_rtl:1.0 u_ocl_region_M02_AXI
create_bd_intf_pin -mode Monitor -vlnv xilinx.com:interface:aximm_rtl:1.0 u_ocl_region_M03_AXI
create_bd_pin -dir I -type clk clkwiz_kernel_clk_out1
create_bd_pin -dir I -type clk clkwiz_sysclks_clk_out1
create_bd_pin -dir I -type clk clkwiz_sysclks_clk_out2
create_bd_pin -dir I -type clk dma_pcie_axi_aclk
create_bd_pin -dir I -from 0 -to 0 -type rst psreset_gate_pr_apmclk_interconnect_aresetn
create_bd_pin -dir I -from 0 -to 0 -type rst psreset_gate_pr_control_interconnect_aresetn
create_bd_pin -dir I -from 0 -to 0 -type rst psreset_gate_pr_data_interconnect_aresetn
create_bd_pin -dir I -from 0 -to 0 -type rst psreset_gate_pr_kernel_interconnect_axiresetn

create_bd_cell -type ip -vlnv xilinx.com:ip:axi_register_slice:2.1 regslice_apm_a
create_bd_cell -type ip -vlnv xilinx.com:ip:axi_register_slice:2.1 regslice_apm_b
create_bd_cell -type ip -vlnv xilinx.com:ip:axi_register_slice:2.1 regslice_fifo_a
create_bd_cell -type ip -vlnv xilinx.com:ip:axi_register_slice:2.1 regslice_fifo_b
create_bd_cell -type ip -vlnv xilinx.com:ip:axi_perf_mon:5.0 xilmonitor_apm
set_property -dict [list \
  CONFIG.C_FIFO_AXIS_DEPTH 16 \
  CONFIG.C_REG_ALL_MONITOR_SIGNALS 1 \
  CONFIG.C_NUM_MONITOR_SLOTS 5 \
  CONFIG.C_SHOW_AXI_IDS 0 \
  CONFIG.C_SHOW_AXI_LEN 1 \
  CONFIG.C_ENABLE_PROFILE 1 \
  CONFIG.C_ENABLE_TRACE 1 \
  CONFIG.C_EN_WR_ADD_FLAG 1 \
  CONFIG.C_EN_FIRST_WRITE_FLAG 0 \
  CONFIG.C_EN_LAST_WRITE_FLAG 1 \
  CONFIG.C_EN_RESPONSE_FLAG 0 \
  CONFIG.C_EN_RD_ADD_FLAG 1 \
  CONFIG.C_EN_FIRST_READ_FLAG 0 \
  CONFIG.C_EN_LAST_READ_FLAG 1 \
  CONFIG.C_EN_EXT_EVENTS_FLAG 1 \
  CONFIG.C_EN_SW_REG_WR_FLAG 1 \
] [get_bd_cells xilmonitor_apm]
create_bd_cell -type ip -vlnv xilinx.com:ip:axi_fifo_mm_s:4.1 xilmonitor_fifo0
set_property -dict [list \
  CONFIG.C_DATA_INTERFACE_TYPE 1 \
  CONFIG.C_RX_FIFO_PF_THRESHOLD 4091 \
  CONFIG.C_RX_FIFO_DEPTH 4096 \
  CONFIG.C_S_AXI4_DATA_WIDTH 256 \
  CONFIG.C_AXIS_TUSER_WIDTH 32 \
  CONFIG.C_USE_RX_CUT_THROUGH true \
  CONFIG.C_USE_TX_DATA 0 \
] [get_bd_cells xilmonitor_fifo0]
create_bd_cell -type ip -vlnv xilinx.com:ip:axis_subset_converter:1.1 xilmonitor_subset0
set_property -dict [list \
  CONFIG.S_TDATA_NUM_BYTES 19 \
  CONFIG.M_TDATA_NUM_BYTES 32 \
  CONFIG.TDATA_REMAP {104'b00000000000000000000000000000000000000000000000000000000000000000000000000000000000000000000000000000000,tdata[151:0]} \
] [get_bd_cells xilmonitor_subset0]

# ---- hierarchy /expanded_region/expanded_resets ----
current_bd_instance /expanded_region/expanded_resets
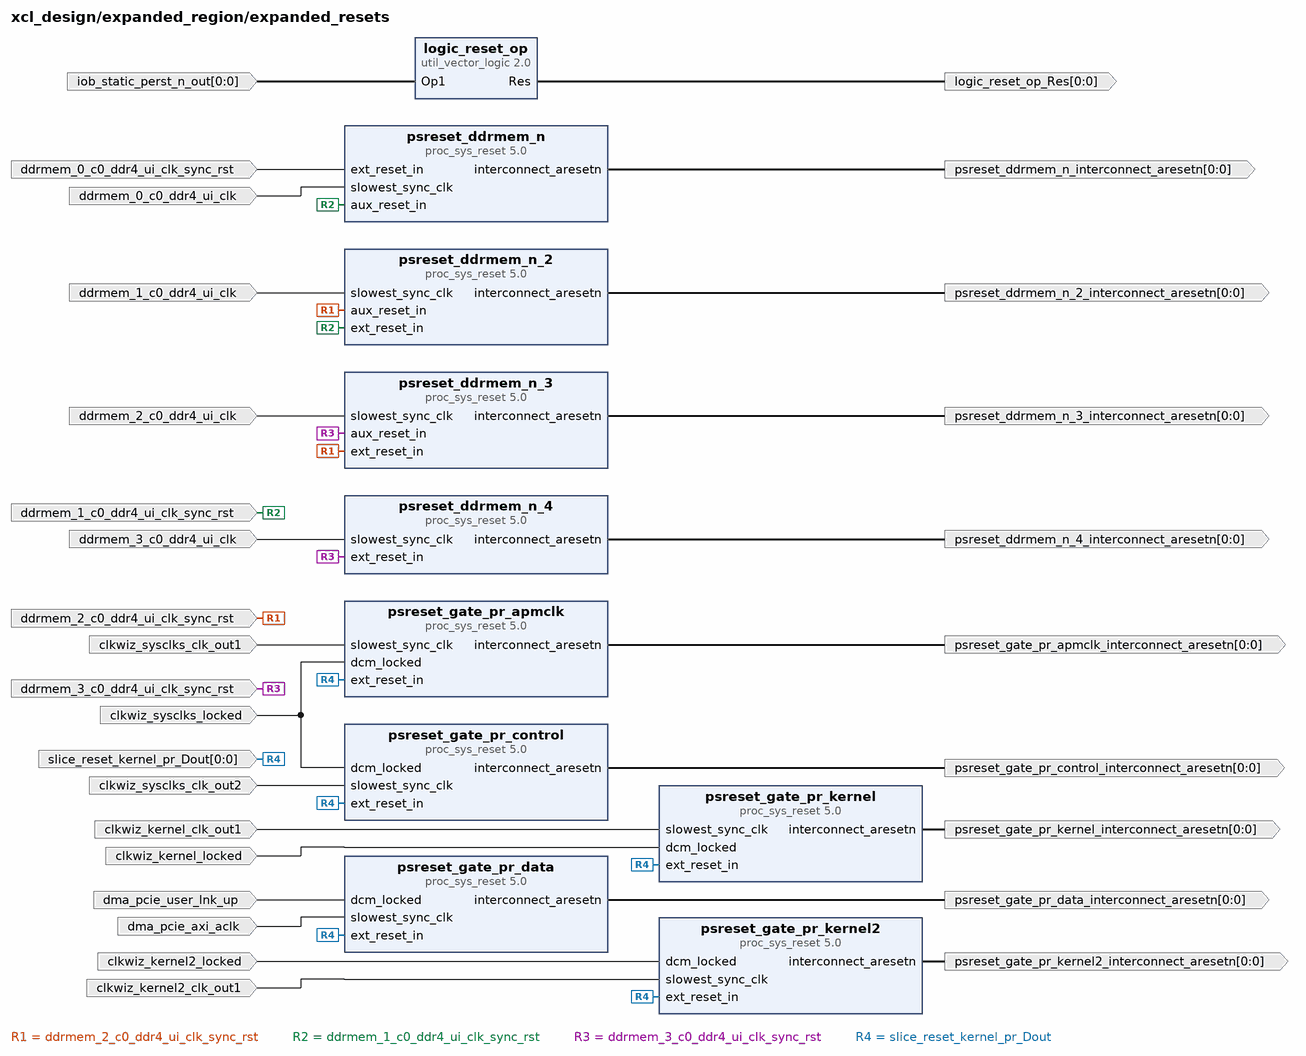
[diagram p8: block diagram inside /expanded_region/expanded_resets]
create_bd_pin -dir I -type clk clkwiz_kernel2_clk_out1
create_bd_pin -dir I clkwiz_kernel2_locked
create_bd_pin -dir I -type clk clkwiz_kernel_clk_out1
create_bd_pin -dir I clkwiz_kernel_locked
create_bd_pin -dir I -type clk clkwiz_sysclks_clk_out1
create_bd_pin -dir I -type clk clkwiz_sysclks_clk_out2
create_bd_pin -dir I clkwiz_sysclks_locked
create_bd_pin -dir I -type clk ddrmem_0_c0_ddr4_ui_clk
create_bd_pin -dir I -type rst ddrmem_0_c0_ddr4_ui_clk_sync_rst
create_bd_pin -dir I -type clk ddrmem_1_c0_ddr4_ui_clk
create_bd_pin -dir I -type rst ddrmem_1_c0_ddr4_ui_clk_sync_rst
create_bd_pin -dir I -type clk ddrmem_2_c0_ddr4_ui_clk
create_bd_pin -dir I -type rst ddrmem_2_c0_ddr4_ui_clk_sync_rst
create_bd_pin -dir I -type clk ddrmem_3_c0_ddr4_ui_clk
create_bd_pin -dir I -type rst ddrmem_3_c0_ddr4_ui_clk_sync_rst
create_bd_pin -dir I -type clk dma_pcie_axi_aclk
create_bd_pin -dir I dma_pcie_user_lnk_up
create_bd_pin -dir I -from 0 -to 0 iob_static_perst_n_out
create_bd_pin -dir O -from 0 -to 0 logic_reset_op_Res
create_bd_pin -dir O -from 0 -to 0 -type rst psreset_ddrmem_n_2_interconnect_aresetn
create_bd_pin -dir O -from 0 -to 0 -type rst psreset_ddrmem_n_3_interconnect_aresetn
create_bd_pin -dir O -from 0 -to 0 -type rst psreset_ddrmem_n_4_interconnect_aresetn
create_bd_pin -dir O -from 0 -to 0 -type rst psreset_ddrmem_n_interconnect_aresetn
create_bd_pin -dir O -from 0 -to 0 -type rst psreset_gate_pr_apmclk_interconnect_aresetn
create_bd_pin -dir O -from 0 -to 0 -type rst psreset_gate_pr_control_interconnect_aresetn
create_bd_pin -dir O -from 0 -to 0 -type rst psreset_gate_pr_data_interconnect_aresetn
create_bd_pin -dir O -from 0 -to 0 -type rst psreset_gate_pr_kernel2_interconnect_aresetn
create_bd_pin -dir O -from 0 -to 0 -type rst psreset_gate_pr_kernel_interconnect_aresetn
create_bd_pin -dir I -from 0 -to 0 -type rst slice_reset_kernel_pr_Dout

create_bd_cell -type ip -vlnv xilinx.com:ip:util_vector_logic:2.0 logic_reset_op
set_property -dict {CONFIG.C_SIZE 1 CONFIG.C_OPERATION not} [get_bd_cells logic_reset_op]
create_bd_cell -type ip -vlnv xilinx.com:ip:proc_sys_reset:5.0 psreset_ddrmem_n
set_property -dict {CONFIG.C_AUX_RST_WIDTH 1 CONFIG.C_EXT_RST_WIDTH 1} [get_bd_cells psreset_ddrmem_n]
create_bd_cell -type ip -vlnv xilinx.com:ip:proc_sys_reset:5.0 psreset_ddrmem_n_2
set_property -dict {CONFIG.C_AUX_RST_WIDTH 1 CONFIG.C_EXT_RST_WIDTH 1} [get_bd_cells psreset_ddrmem_n_2]
create_bd_cell -type ip -vlnv xilinx.com:ip:proc_sys_reset:5.0 psreset_ddrmem_n_3
set_property -dict {CONFIG.C_AUX_RST_WIDTH 1 CONFIG.C_EXT_RST_WIDTH 1} [get_bd_cells psreset_ddrmem_n_3]
create_bd_cell -type ip -vlnv xilinx.com:ip:proc_sys_reset:5.0 psreset_ddrmem_n_4
set_property -dict {CONFIG.C_AUX_RST_WIDTH 1 CONFIG.C_EXT_RST_WIDTH 1} [get_bd_cells psreset_ddrmem_n_4]
create_bd_cell -type ip -vlnv xilinx.com:ip:proc_sys_reset:5.0 psreset_gate_pr_apmclk
create_bd_cell -type ip -vlnv xilinx.com:ip:proc_sys_reset:5.0 psreset_gate_pr_control
set_property -dict {CONFIG.C_AUX_RST_WIDTH 1 CONFIG.C_EXT_RST_WIDTH 1} [get_bd_cells psreset_gate_pr_control]
create_bd_cell -type ip -vlnv xilinx.com:ip:proc_sys_reset:5.0 psreset_gate_pr_data
set_property -dict {CONFIG.C_AUX_RST_WIDTH 1 CONFIG.C_EXT_RST_WIDTH 1} [get_bd_cells psreset_gate_pr_data]
create_bd_cell -type ip -vlnv xilinx.com:ip:proc_sys_reset:5.0 psreset_gate_pr_kernel
set_property -dict {CONFIG.C_AUX_RST_WIDTH 1 CONFIG.C_EXT_RST_WIDTH 1} [get_bd_cells psreset_gate_pr_kernel]
create_bd_cell -type ip -vlnv xilinx.com:ip:proc_sys_reset:5.0 psreset_gate_pr_kernel2
set_property -dict {CONFIG.C_AUX_RST_WIDTH 1 CONFIG.C_EXT_RST_WIDTH 1} [get_bd_cells psreset_gate_pr_kernel2]

# ---- hierarchy /expanded_region/interconnect ----
current_bd_instance /expanded_region/interconnect
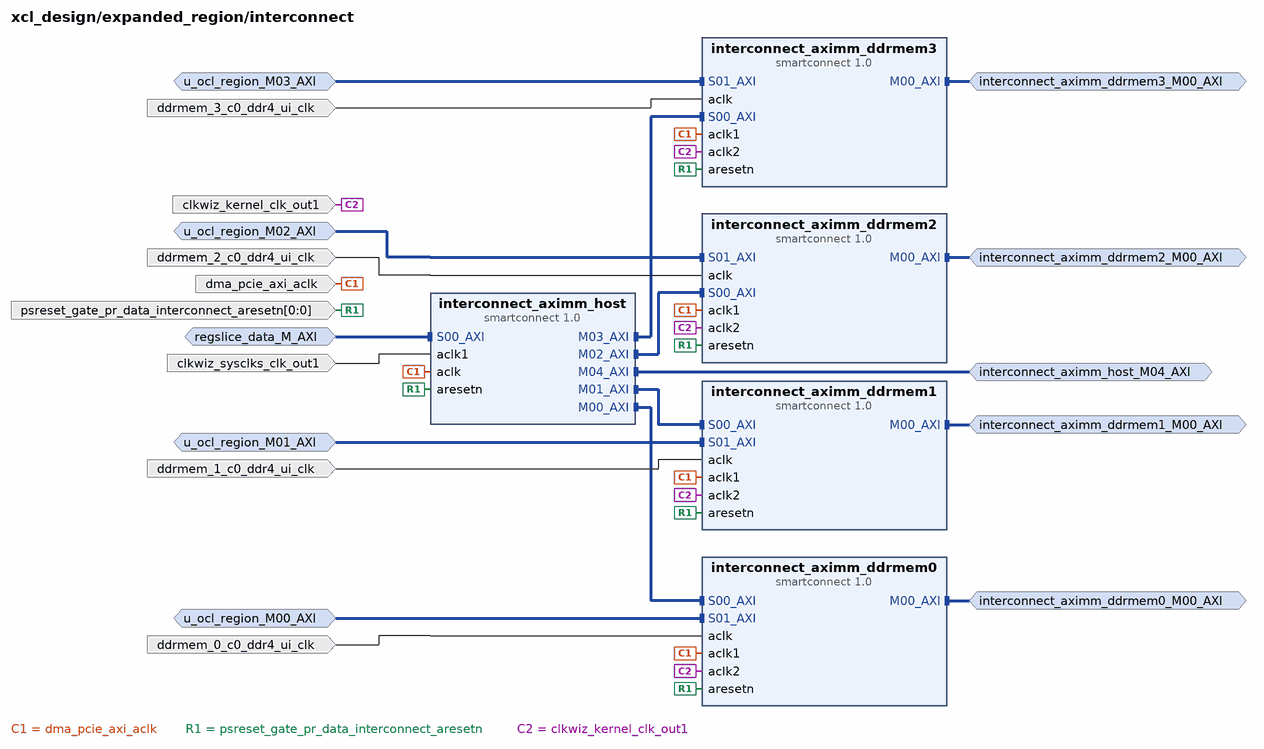
[diagram p9: block diagram inside /expanded_region/interconnect]
create_bd_intf_pin -mode Master -vlnv xilinx.com:interface:aximm_rtl:1.0 interconnect_aximm_ddrmem0_M00_AXI
create_bd_intf_pin -mode Master -vlnv xilinx.com:interface:aximm_rtl:1.0 interconnect_aximm_ddrmem1_M00_AXI
create_bd_intf_pin -mode Master -vlnv xilinx.com:interface:aximm_rtl:1.0 interconnect_aximm_ddrmem2_M00_AXI
create_bd_intf_pin -mode Master -vlnv xilinx.com:interface:aximm_rtl:1.0 interconnect_aximm_ddrmem3_M00_AXI
create_bd_intf_pin -mode Master -vlnv xilinx.com:interface:aximm_rtl:1.0 interconnect_aximm_host_M04_AXI
create_bd_intf_pin -mode Slave -vlnv xilinx.com:interface:aximm_rtl:1.0 regslice_data_M_AXI
create_bd_intf_pin -mode Slave -vlnv xilinx.com:interface:aximm_rtl:1.0 u_ocl_region_M00_AXI
create_bd_intf_pin -mode Slave -vlnv xilinx.com:interface:aximm_rtl:1.0 u_ocl_region_M01_AXI
create_bd_intf_pin -mode Slave -vlnv xilinx.com:interface:aximm_rtl:1.0 u_ocl_region_M02_AXI
create_bd_intf_pin -mode Slave -vlnv xilinx.com:interface:aximm_rtl:1.0 u_ocl_region_M03_AXI
create_bd_pin -dir I -type clk clkwiz_kernel_clk_out1
create_bd_pin -dir I -type clk clkwiz_sysclks_clk_out1
create_bd_pin -dir I -type clk ddrmem_0_c0_ddr4_ui_clk
create_bd_pin -dir I -type clk ddrmem_1_c0_ddr4_ui_clk
create_bd_pin -dir I -type clk ddrmem_2_c0_ddr4_ui_clk
create_bd_pin -dir I -type clk ddrmem_3_c0_ddr4_ui_clk
create_bd_pin -dir I -type clk dma_pcie_axi_aclk
create_bd_pin -dir I -from 0 -to 0 -type rst psreset_gate_pr_data_interconnect_aresetn

create_bd_cell -type ip -vlnv xilinx.com:ip:smartconnect:1.0 interconnect_aximm_ddrmem0
set_property -dict [list \
  CONFIG.NUM_CLKS 3 \
  CONFIG.ADVANCED_PROPERTIES {subcore_assignments { s*_entry_pipeline/s*_mmu { CONFIG.ENABLE_PIPELINING 0x0 CONFIG.SUPPORTS_WRITE_DECERR 0 CONFIG.SUPPORTS_READ_DECERR 0 } m*_exit_pipeline/m*_exit { CONFIG.ENABLE_PIPELINING 0x0 } s00_nodes/s00_r_node { CONFIG.FIFO_TYPE 1 CONFIG.FIFO_SIZE 9 } s00_nodes/s00_w_node { CONFIG.FIFO_TYPE 1 CONFIG.FIFO_SIZE 9 } s01_entry_pipeline/s01_si_converter { CONFIG.READ_WATERMARK 0 CONFIG.WRITE_WATERMARK 0 } s01_nodes/s01_ar_node { CONFIG.ENABLE_PIPELINING 0x07 } s01_nodes/s01_r_node { CONFIG.ENABLE_PIPELINING 0x06 CONFIG.FIFO_TYPE 1 CONFIG.FIFO_SIZE 9 } s01_nodes/s01_aw_node { CONFIG.ENABLE_PIPELINING 0x07 } s01_nodes/s01_w_node { CONFIG.ENABLE_PIPELINING 0x07 CONFIG.FIFO_TYPE 1 CONFIG.FIFO_SIZE 9 } s01_nodes/s01_b_node { CONFIG.ENABLE_PIPELINING 0x06 } m00_nodes/m00_r_node { CONFIG.ENABLE_PIPELINING 0x03 } }} \
] [get_bd_cells interconnect_aximm_ddrmem0]
create_bd_cell -type ip -vlnv xilinx.com:ip:smartconnect:1.0 interconnect_aximm_ddrmem1
set_property -dict [list \
  CONFIG.NUM_CLKS 3 \
  CONFIG.ADVANCED_PROPERTIES {subcore_assignments { s*_entry_pipeline/s*_mmu { CONFIG.ENABLE_PIPELINING 0x0 CONFIG.SUPPORTS_WRITE_DECERR 0 CONFIG.SUPPORTS_READ_DECERR 0 } m*_exit_pipeline/m*_exit { CONFIG.ENABLE_PIPELINING 0x0 } s00_nodes/s00_r_node { CONFIG.FIFO_TYPE 1 CONFIG.FIFO_SIZE 9 } s00_nodes/s00_w_node { CONFIG.FIFO_TYPE 1 CONFIG.FIFO_SIZE 9 } s01_entry_pipeline/s01_si_converter { CONFIG.READ_WATERMARK 0 CONFIG.WRITE_WATERMARK 0 } s01_nodes/s01_ar_node { CONFIG.ENABLE_PIPELINING 0x07 } s01_nodes/s01_r_node { CONFIG.ENABLE_PIPELINING 0x06 CONFIG.FIFO_TYPE 1 CONFIG.FIFO_SIZE 9 } s01_nodes/s01_aw_node { CONFIG.ENABLE_PIPELINING 0x07 } s01_nodes/s01_w_node { CONFIG.ENABLE_PIPELINING 0x07 CONFIG.FIFO_TYPE 1 CONFIG.FIFO_SIZE 9 } s01_nodes/s01_b_node { CONFIG.ENABLE_PIPELINING 0x06 } m00_nodes/m00_r_node { CONFIG.ENABLE_PIPELINING 0x03 } }} \
] [get_bd_cells interconnect_aximm_ddrmem1]
create_bd_cell -type ip -vlnv xilinx.com:ip:smartconnect:1.0 interconnect_aximm_ddrmem2
set_property -dict [list \
  CONFIG.NUM_CLKS 3 \
  CONFIG.ADVANCED_PROPERTIES {subcore_assignments { s*_entry_pipeline/s*_mmu { CONFIG.ENABLE_PIPELINING 0x0 CONFIG.SUPPORTS_WRITE_DECERR 0 CONFIG.SUPPORTS_READ_DECERR 0 } m*_exit_pipeline/m*_exit { CONFIG.ENABLE_PIPELINING 0x0 } s00_nodes/s00_ar_node { CONFIG.ENABLE_PIPELINING 0x07 } s00_nodes/s00_r_node { CONFIG.ENABLE_PIPELINING 0x06 CONFIG.FIFO_TYPE 1 CONFIG.FIFO_SIZE 9 } s00_nodes/s00_aw_node { CONFIG.ENABLE_PIPELINING 0x07 } s00_nodes/s00_w_node { CONFIG.ENABLE_PIPELINING 0x07 CONFIG.FIFO_TYPE 1 CONFIG.FIFO_SIZE 9 } s00_nodes/s00_b_node { CONFIG.ENABLE_PIPELINING 0x06 } s01_nodes/s01_ar_node { CONFIG.ENABLE_PIPELINING 0x07 } s01_entry_pipeline/s01_si_converter { CONFIG.READ_WATERMARK 0 CONFIG.WRITE_WATERMARK 0 } s01_nodes/s01_r_node { CONFIG.ENABLE_PIPELINING 0x06 CONFIG.FIFO_TYPE 1 CONFIG.FIFO_SIZE 9 } s01_nodes/s01_aw_node { CONFIG.ENABLE_PIPELINING 0x07 } s01_nodes/s01_w_node { CONFIG.ENABLE_PIPELINING 0x07 CONFIG.FIFO_TYPE 1 CONFIG.FIFO_SIZE 9 } s01_nodes/s01_b_node { CONFIG.ENABLE_PIPELINING 0x06 } m00_nodes/m00_r_node { CONFIG.ENABLE_PIPELINING 0x03 } }} \
] [get_bd_cells interconnect_aximm_ddrmem2]
create_bd_cell -type ip -vlnv xilinx.com:ip:smartconnect:1.0 interconnect_aximm_ddrmem3
set_property -dict [list \
  CONFIG.NUM_CLKS 3 \
  CONFIG.ADVANCED_PROPERTIES {subcore_assignments { s*_entry_pipeline/s*_mmu { CONFIG.ENABLE_PIPELINING 0x0 CONFIG.SUPPORTS_WRITE_DECERR 0 CONFIG.SUPPORTS_READ_DECERR 0 } m*_exit_pipeline/m*_exit { CONFIG.ENABLE_PIPELINING 0x0 } s00_nodes/s00_ar_node { CONFIG.ENABLE_PIPELINING 0x07 } s00_nodes/s00_r_node { CONFIG.ENABLE_PIPELINING 0x06 CONFIG.FIFO_TYPE 1 CONFIG.FIFO_SIZE 9 } s00_nodes/s00_aw_node { CONFIG.ENABLE_PIPELINING 0x07 } s00_nodes/s00_w_node { CONFIG.ENABLE_PIPELINING 0x07 CONFIG.FIFO_TYPE 1 CONFIG.FIFO_SIZE 9 } s00_nodes/s00_b_node { CONFIG.ENABLE_PIPELINING 0x06 } s01_nodes/s01_ar_node { CONFIG.ENABLE_PIPELINING 0x07 } s01_entry_pipeline/s01_si_converter { CONFIG.READ_WATERMARK 0 CONFIG.WRITE_WATERMARK 0 } s01_nodes/s01_r_node { CONFIG.ENABLE_PIPELINING 0x06 CONFIG.FIFO_TYPE 1 CONFIG.FIFO_SIZE 9 } s01_nodes/s01_aw_node { CONFIG.ENABLE_PIPELINING 0x07 } s01_nodes/s01_w_node { CONFIG.ENABLE_PIPELINING 0x07 CONFIG.FIFO_TYPE 1 CONFIG.FIFO_SIZE 9 } s01_nodes/s01_b_node { CONFIG.ENABLE_PIPELINING 0x06 } m00_nodes/m00_r_node { CONFIG.ENABLE_PIPELINING 0x03 } }} \
] [get_bd_cells interconnect_aximm_ddrmem3]
create_bd_cell -type ip -vlnv xilinx.com:ip:smartconnect:1.0 interconnect_aximm_host
set_property -dict [list \
  CONFIG.NUM_MI 5 \
  CONFIG.NUM_SI 1 \
  CONFIG.NUM_CLKS 2 \
  CONFIG.ADVANCED_PROPERTIES {_sc_override_ { mi_properties { M00_AXI { CONFIG.DATA_WIDTH 256 } M01_AXI { CONFIG.DATA_WIDTH 256 } M02_AXI { CONFIG.DATA_WIDTH 256 } M03_AXI { CONFIG.DATA_WIDTH 256 } M04_AXI { CONFIG.DATA_WIDTH 256 } } } subcore_assignments { s00_entry_pipeline/s00_si_converter { CONFIG.READ_WATERMARK 0 CONFIG.WRITE_WATERMARK 0 } s*_entry_pipeline/s*_mmu { CONFIG.ENABLE_PIPELINING 0x1 } m*_exit_pipeline/m*_exit { CONFIG.ENABLE_PIPELINING 0x0 } m04_nodes/m04_ar_node { CONFIG.ENABLE_PIPELINING 0x07 } m04_nodes/m04_r_node { CONFIG.ENABLE_PIPELINING 0x06 } m04_nodes/m04_aw_node { CONFIG.ENABLE_PIPELINING 0x07 } m04_nodes/m04_w_node { CONFIG.ENABLE_PIPELINING 0x07 } m04_nodes/m04_b_node { CONFIG.ENABLE_PIPELINING 0x06 } }} \
] [get_bd_cells interconnect_aximm_host]

# ---- hierarchy /expanded_region/memc ----
current_bd_instance /expanded_region/memc
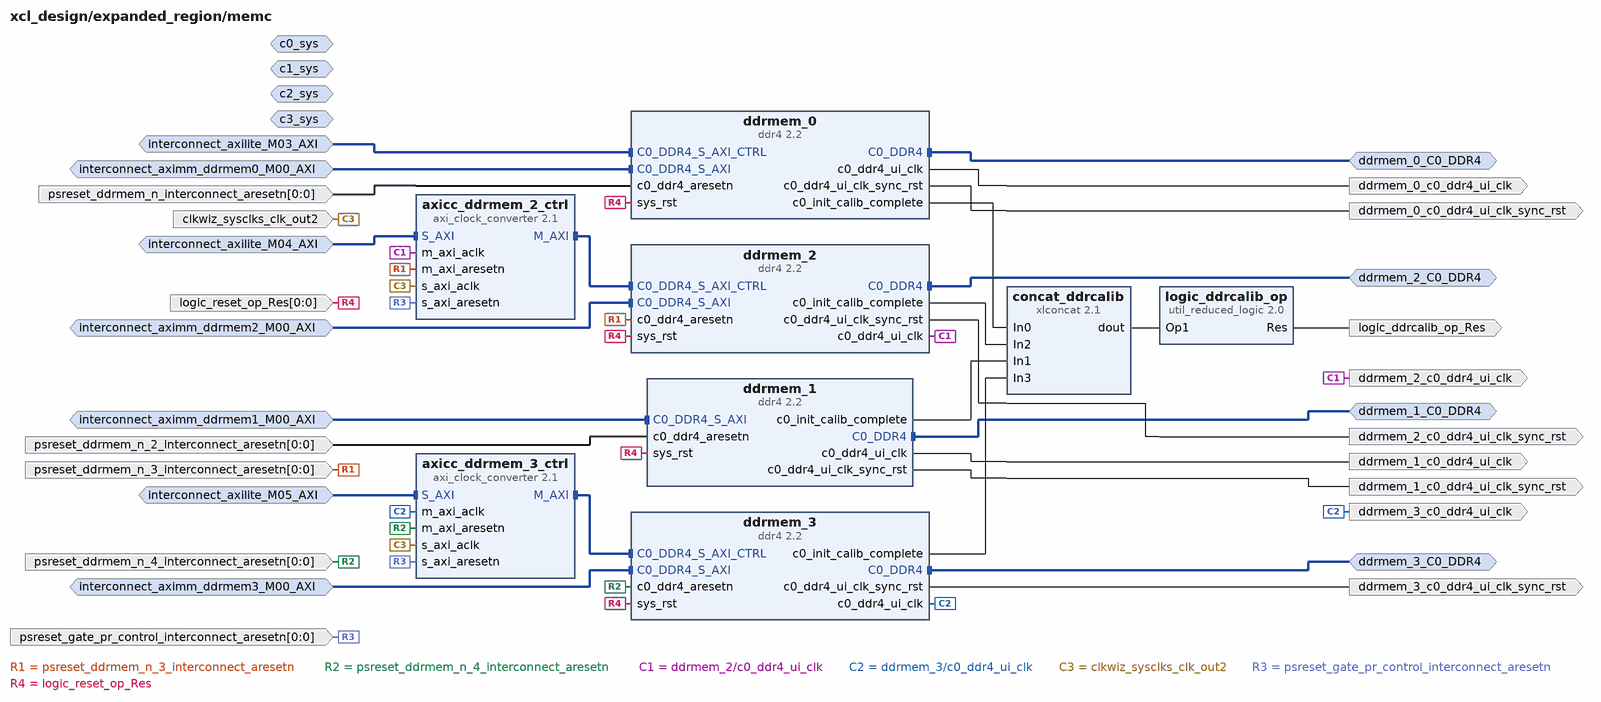
[diagram p10: block diagram inside /expanded_region/memc]
create_bd_intf_pin -mode Slave -vlnv xilinx.com:interface:diff_clock_rtl:1.0 c0_sys
create_bd_intf_pin -mode Slave -vlnv xilinx.com:interface:diff_clock_rtl:1.0 c1_sys
create_bd_intf_pin -mode Slave -vlnv xilinx.com:interface:diff_clock_rtl:1.0 c2_sys
create_bd_intf_pin -mode Slave -vlnv xilinx.com:interface:diff_clock_rtl:1.0 c3_sys
create_bd_intf_pin -mode Master -vlnv xilinx.com:interface:ddr4_rtl:1.0 ddrmem_0_C0_DDR4
create_bd_intf_pin -mode Master -vlnv xilinx.com:interface:ddr4_rtl:1.0 ddrmem_1_C0_DDR4
create_bd_intf_pin -mode Master -vlnv xilinx.com:interface:ddr4_rtl:1.0 ddrmem_2_C0_DDR4
create_bd_intf_pin -mode Master -vlnv xilinx.com:interface:ddr4_rtl:1.0 ddrmem_3_C0_DDR4
create_bd_intf_pin -mode Slave -vlnv xilinx.com:interface:aximm_rtl:1.0 interconnect_axilite_M03_AXI
create_bd_intf_pin -mode Slave -vlnv xilinx.com:interface:aximm_rtl:1.0 interconnect_axilite_M04_AXI
create_bd_intf_pin -mode Slave -vlnv xilinx.com:interface:aximm_rtl:1.0 interconnect_axilite_M05_AXI
create_bd_intf_pin -mode Slave -vlnv xilinx.com:interface:aximm_rtl:1.0 interconnect_aximm_ddrmem0_M00_AXI
create_bd_intf_pin -mode Slave -vlnv xilinx.com:interface:aximm_rtl:1.0 interconnect_aximm_ddrmem1_M00_AXI
create_bd_intf_pin -mode Slave -vlnv xilinx.com:interface:aximm_rtl:1.0 interconnect_aximm_ddrmem2_M00_AXI
create_bd_intf_pin -mode Slave -vlnv xilinx.com:interface:aximm_rtl:1.0 interconnect_aximm_ddrmem3_M00_AXI
create_bd_pin -dir I -type clk clkwiz_sysclks_clk_out2
create_bd_pin -dir O -type clk ddrmem_0_c0_ddr4_ui_clk
create_bd_pin -dir O -type rst ddrmem_0_c0_ddr4_ui_clk_sync_rst
create_bd_pin -dir O -type clk ddrmem_1_c0_ddr4_ui_clk
create_bd_pin -dir O -type rst ddrmem_1_c0_ddr4_ui_clk_sync_rst
create_bd_pin -dir O -type clk ddrmem_2_c0_ddr4_ui_clk
create_bd_pin -dir O -type rst ddrmem_2_c0_ddr4_ui_clk_sync_rst
create_bd_pin -dir O -type clk ddrmem_3_c0_ddr4_ui_clk
create_bd_pin -dir O -type rst ddrmem_3_c0_ddr4_ui_clk_sync_rst
create_bd_pin -dir O logic_ddrcalib_op_Res
create_bd_pin -dir I -from 0 -to 0 -type rst logic_reset_op_Res
create_bd_pin -dir I -from 0 -to 0 -type rst psreset_ddrmem_n_2_interconnect_aresetn
create_bd_pin -dir I -from 0 -to 0 -type rst psreset_ddrmem_n_3_interconnect_aresetn
create_bd_pin -dir I -from 0 -to 0 -type rst psreset_ddrmem_n_4_interconnect_aresetn
create_bd_pin -dir I -from 0 -to 0 -type rst psreset_ddrmem_n_interconnect_aresetn
create_bd_pin -dir I -from 0 -to 0 -type rst psreset_gate_pr_control_interconnect_aresetn

create_bd_cell -type ip -vlnv xilinx.com:ip:axi_clock_converter:2.1 axicc_ddrmem_2_ctrl
create_bd_cell -type ip -vlnv xilinx.com:ip:axi_clock_converter:2.1 axicc_ddrmem_3_ctrl
create_bd_cell -type ip -vlnv xilinx.com:ip:xlconcat:2.1 concat_ddrcalib
set_property -dict {CONFIG.NUM_PORTS 4} [get_bd_cells concat_ddrcalib]
create_bd_cell -type ip -vlnv xilinx.com:ip:ddr4:2.2 ddrmem_0
set_property -dict [list \
  CONFIG.C0.DDR4_TimePeriod 833 \
  CONFIG.C0.DDR4_InputClockPeriod 3332 \
  CONFIG.C0.DDR4_MemoryType Components \
  CONFIG.C0.DDR4_MemoryPart MT40A512M16HA-083E \
  CONFIG.C0.DDR4_DataWidth 72 \
  CONFIG.C0.DDR4_CasLatency 16 \
  CONFIG.C0.DDR4_CasWriteLatency 12 \
  CONFIG.C0.DDR4_AxiDataWidth 512 \
  CONFIG.C0.DDR4_AxiAddressWidth 32 \
  CONFIG.C0.DDR4_isCustom false \
] [get_bd_cells ddrmem_0]
create_bd_cell -type ip -vlnv xilinx.com:ip:ddr4:2.2 ddrmem_1
set_property -dict [list \
  CONFIG.C0.DDR4_TimePeriod 833 \
  CONFIG.C0.DDR4_InputClockPeriod 3332 \
  CONFIG.C0.DDR4_MemoryType Components \
  CONFIG.C0.DDR4_MemoryPart MT40A512M16HA-083E \
  CONFIG.C0.DDR4_DataWidth 64 \
  CONFIG.C0.DDR4_CasLatency 16 \
  CONFIG.C0.DDR4_CasWriteLatency 12 \
  CONFIG.C0.DDR4_AxiDataWidth 512 \
  CONFIG.C0.DDR4_AxiAddressWidth 32 \
  CONFIG.C0.DDR4_isCustom false \
] [get_bd_cells ddrmem_1]
create_bd_cell -type ip -vlnv xilinx.com:ip:ddr4:2.2 ddrmem_2
set_property -dict [list \
  CONFIG.C0.DDR4_TimePeriod 833 \
  CONFIG.C0.DDR4_InputClockPeriod 3332 \
  CONFIG.C0.DDR4_MemoryType Components \
  CONFIG.C0.DDR4_MemoryPart MT40A512M16HA-083E \
  CONFIG.C0.DDR4_DataWidth 72 \
  CONFIG.C0.DDR4_CasLatency 16 \
  CONFIG.C0.DDR4_CasWriteLatency 12 \
  CONFIG.C0.DDR4_AxiDataWidth 512 \
  CONFIG.C0.DDR4_AxiAddressWidth 32 \
  CONFIG.C0.DDR4_isCustom false \
] [get_bd_cells ddrmem_2]
create_bd_cell -type ip -vlnv xilinx.com:ip:ddr4:2.2 ddrmem_3
set_property -dict [list \
  CONFIG.C0.DDR4_TimePeriod 833 \
  CONFIG.C0.DDR4_InputClockPeriod 3332 \
  CONFIG.C0.DDR4_MemoryType Components \
  CONFIG.C0.DDR4_MemoryPart MT40A512M16HA-083E \
  CONFIG.C0.DDR4_DataWidth 72 \
  CONFIG.C0.DDR4_CasLatency 16 \
  CONFIG.C0.DDR4_CasWriteLatency 12 \
  CONFIG.C0.DDR4_AxiDataWidth 512 \
  CONFIG.C0.DDR4_AxiAddressWidth 32 \
  CONFIG.C0.DDR4_isCustom false \
] [get_bd_cells ddrmem_3]
create_bd_cell -type ip -vlnv xilinx.com:ip:util_reduced_logic:2.0 logic_ddrcalib_op
set_property -dict {CONFIG.C_SIZE 4 CONFIG.C_OPERATION and} [get_bd_cells logic_ddrcalib_op]

# ---- hierarchy /expanded_region/pr_support_expanded ----
current_bd_instance /expanded_region/pr_support_expanded
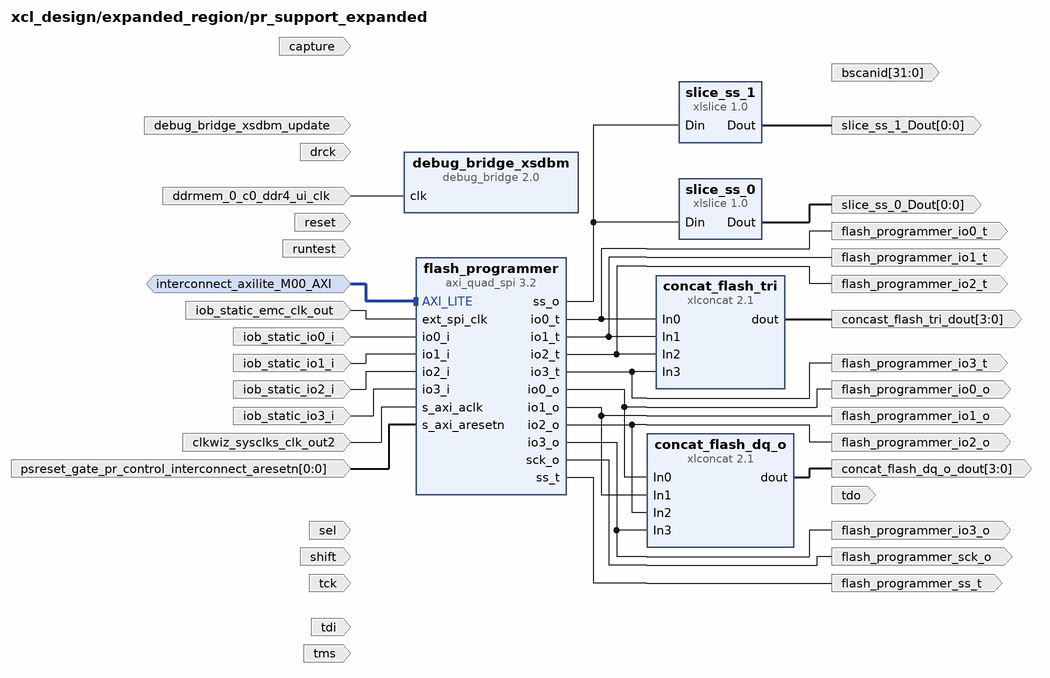
[diagram p11: block diagram inside /expanded_region/pr_support_expanded]
create_bd_intf_pin -mode Slave -vlnv xilinx.com:interface:aximm_rtl:1.0 interconnect_axilite_M00_AXI
create_bd_pin -dir O -from 31 -to 0 bscanid
create_bd_pin -dir I capture
create_bd_pin -dir I -type clk clkwiz_sysclks_clk_out2
create_bd_pin -dir O -from 3 -to 0 concast_flash_tri_dout
create_bd_pin -dir O -from 3 -to 0 concat_flash_dq_o_dout
create_bd_pin -dir I -type clk ddrmem_0_c0_ddr4_ui_clk
create_bd_pin -dir I debug_bridge_xsdbm_update
create_bd_pin -dir I drck
create_bd_pin -dir O flash_programmer_io0_o
create_bd_pin -dir O flash_programmer_io0_t
create_bd_pin -dir O flash_programmer_io1_o
create_bd_pin -dir O flash_programmer_io1_t
create_bd_pin -dir O flash_programmer_io2_o
create_bd_pin -dir O flash_programmer_io2_t
create_bd_pin -dir O flash_programmer_io3_o
create_bd_pin -dir O flash_programmer_io3_t
create_bd_pin -dir O flash_programmer_sck_o
create_bd_pin -dir O flash_programmer_ss_t
create_bd_pin -dir I -type clk iob_static_emc_clk_out
create_bd_pin -dir I iob_static_io0_i
create_bd_pin -dir I iob_static_io1_i
create_bd_pin -dir I iob_static_io2_i
create_bd_pin -dir I iob_static_io3_i
create_bd_pin -dir I -from 0 -to 0 -type rst psreset_gate_pr_control_interconnect_aresetn
create_bd_pin -dir I reset
create_bd_pin -dir I runtest
create_bd_pin -dir I sel
create_bd_pin -dir I shift
create_bd_pin -dir O -from 0 -to 0 slice_ss_0_Dout
create_bd_pin -dir O -from 0 -to 0 slice_ss_1_Dout
create_bd_pin -dir I tck
create_bd_pin -dir I tdi
create_bd_pin -dir O tdo
create_bd_pin -dir I tms

create_bd_cell -type ip -vlnv xilinx.com:ip:xlconcat:2.1 concat_flash_dq_o
set_property -dict {CONFIG.NUM_PORTS 4} [get_bd_cells concat_flash_dq_o]
create_bd_cell -type ip -vlnv xilinx.com:ip:xlconcat:2.1 concat_flash_tri
set_property -dict {CONFIG.NUM_PORTS 4} [get_bd_cells concat_flash_tri]
create_bd_cell -type ip -vlnv xilinx.com:ip:debug_bridge:2.0 debug_bridge_xsdbm
set_property -dict {CONFIG.C_DEBUG_MODE 1 CONFIG.C_ENABLE_CLK_DIVIDER true} [get_bd_cells debug_bridge_xsdbm]
create_bd_cell -type ip -vlnv xilinx.com:ip:axi_quad_spi:3.2 flash_programmer
set_property -dict [list \
  CONFIG.C_SPI_MEMORY 2 \
  CONFIG.C_USE_STARTUP 1 \
  CONFIG.C_USE_STARTUP_INT 0 \
  CONFIG.C_SPI_MODE 2 \
  CONFIG.C_NUM_SS_BITS 2 \
  CONFIG.C_FIFO_DEPTH 256 \
  CONFIG.C_TYPE_OF_AXI4_INTERFACE 0 \
] [get_bd_cells flash_programmer]
create_bd_cell -type ip -vlnv xilinx.com:ip:xlslice:1.0 slice_ss_0
set_property -dict {CONFIG.DIN_TO 0 CONFIG.DIN_FROM 0 CONFIG.DIN_WIDTH 2} [get_bd_cells slice_ss_0]
create_bd_cell -type ip -vlnv xilinx.com:ip:xlslice:1.0 slice_ss_1
set_property -dict {CONFIG.DIN_TO 1 CONFIG.DIN_FROM 1 CONFIG.DIN_WIDTH 2} [get_bd_cells slice_ss_1]

# ---- connections ----

current_bd_instance /base_region
connect_bd_intf_net [get_bd_intf_pins dma_pcie/M_AXI] [get_bd_intf_pins pr_isolation_expanded/dma_pcie_M_AXI]
connect_bd_intf_net [get_bd_intf_pins dma_pcie/M_AXI_LITE] [get_bd_intf_pins pr_isolation_expanded/dma_pcie_M_AXI_LITE]
connect_bd_intf_net [get_bd_intf_pins featureid/interconnect_axilite_static_M02_AXI] [get_bd_intf_pins pr_isolation_expanded/interconnect_axilite_static_M02_AXI]
connect_bd_intf_net [get_bd_intf_pins base_clocking/interconnect_axilite_static_M03_AXI] [get_bd_intf_pins pr_isolation_expanded/interconnect_axilite_static_M03_AXI]
connect_bd_intf_net [get_bd_intf_pins axi_i2c/S_AXI] [get_bd_intf_pins pr_isolation_expanded/interconnect_axilite_static_M05_AXI]
connect_bd_intf_net [get_bd_intf_pins base_clocking/interconnect_axilite_static_M06_AXI] [get_bd_intf_pins pr_isolation_expanded/interconnect_axilite_static_M06_AXI]
connect_bd_intf_net [get_bd_intf_pins pr_isolation_expanded/interconnect_axilite_static_M07_AXI] [get_bd_intf_pins sys_mgmt_wiz/S_AXI_LITE]
connect_bd_intf_net [get_bd_intf_pins axi_i2c_IIC] [get_bd_intf_pins axi_i2c/IIC]
connect_bd_intf_net [get_bd_intf_pins dma_pcie_pcie_mgt] [get_bd_intf_pins dma_pcie/pcie_mgt]
connect_bd_intf_net [get_bd_intf_pins regslice_control_M_AXI] [get_bd_intf_pins pr_isolation_expanded/regslice_control_M_AXI]
connect_bd_intf_net [get_bd_intf_pins regslice_data_M_AXI] [get_bd_intf_pins pr_isolation_expanded/regslice_data_M_AXI]
connect_bd_net [get_bd_pins iob_static_ss] [get_bd_pins pr_isolation_expanded/iob_static_ss]
connect_bd_net [get_bd_pins iob_static_io0] [get_bd_pins pr_isolation_expanded/iob_static_io0]
connect_bd_net [get_bd_pins iob_static_io1] [get_bd_pins pr_isolation_expanded/iob_static_io1]
connect_bd_net [get_bd_pins iob_static_io2] [get_bd_pins pr_isolation_expanded/iob_static_io2]
connect_bd_net [get_bd_pins iob_static_io3] [get_bd_pins pr_isolation_expanded/iob_static_io3]
connect_bd_net [get_bd_pins axi_i2c/gpo] [get_bd_pins axi_i2c_gpo]
connect_bd_net -net base_clocking_IBUF_DS_ODIV2 [get_bd_pins base_clocking/buf_refclk_ibuf_IBUF_DS_ODIV2] [get_bd_pins dma_pcie/sys_clk]
connect_bd_net -net base_clocking_IBUF_OUT [get_bd_pins base_clocking/buf_refclk_ibuf_IBUF_OUT] [get_bd_pins dma_pcie/sys_clk_gt]
connect_bd_net -net base_clocking_clk_out1 [get_bd_pins base_clocking/clkwiz_kernel_clk_out1] [get_bd_pins clkwiz_kernel_clk_out1]
connect_bd_net -net base_clocking_clk_out2 [get_bd_pins base_clocking/clkwiz_sysclks_clk_out2] \
  [get_bd_pins clkwiz_sysclks_clk_out2] [get_bd_pins axi_i2c/s_axi_aclk] [get_bd_pins sys_mgmt_wiz/s_axi_aclk] \
  [get_bd_pins featureid/clkwiz_sysclks_clk_out2] [get_bd_pins pr_isolation_expanded/clkwiz_sysclks_clk_out2]
connect_bd_net -net base_clocking_clk_out3 [get_bd_pins base_clocking/clkwiz_sysclks_clk_out1] [get_bd_pins clkwiz_sysclks_clk_out1]
connect_bd_net -net base_clocking_clk_out4 [get_bd_pins base_clocking/clkwiz_kernel2_clk_out1] [get_bd_pins clkwiz_kernel2_clk_out1]
connect_bd_net -net base_clocking_interconnect_aresetn [get_bd_pins base_clocking/psreset_ctrlclk_interconnect_aresetn] \
  [get_bd_pins axi_i2c/s_axi_aresetn] [get_bd_pins sys_mgmt_wiz/s_axi_aresetn] \
  [get_bd_pins featureid/psreset_ctrlclk_interconnect_aresetn] \
  [get_bd_pins pr_isolation_expanded/psreset_ctrlclk_interconnect_aresetn]
connect_bd_net -net base_clocking_locked [get_bd_pins base_clocking/clkwiz_kernel_locked] [get_bd_pins clkwiz_kernel_locked]
connect_bd_net -net base_clocking_locked1 [get_bd_pins base_clocking/clkwiz_sysclks_locked] \
  [get_bd_pins clkwiz_sysclks_locked] [get_bd_pins pr_isolation_expanded/clkwiz_sysclks_locked]
connect_bd_net -net base_clocking_locked2 [get_bd_pins base_clocking/clkwiz_kernel2_locked] [get_bd_pins clkwiz_kernel2_locked]
connect_bd_net -net base_tieoffs_dout [get_bd_pins base_tieoffs/const_gnd_1_dout] [get_bd_pins base_clocking/const_gnd_1_dout]
connect_bd_net -net base_tieoffs_dout1 [get_bd_pins base_tieoffs/const_gnd_3_dout] [get_bd_pins base_clocking/const_gnd_3_dout]
connect_bd_net -net base_tieoffs_dout2 [get_bd_pins base_tieoffs/const_vcc_1_dout] [get_bd_pins base_clocking/const_vcc_1_dout]
connect_bd_net [get_bd_pins dma_pcie/axi_aclk] [get_bd_pins dma_pcie_axi_aclk] [get_bd_pins pr_isolation_expanded/dma_pcie_axi_aclk]
connect_bd_net [get_bd_pins dma_pcie/axi_aresetn] [get_bd_pins pr_isolation_expanded/dma_pcie_axi_aresetn]
connect_bd_net [get_bd_pins dma_pcie/user_lnk_up] [get_bd_pins dma_pcie_user_lnk_up] [get_bd_pins pr_isolation_expanded/dma_pcie_user_lnk_up]
connect_bd_net -net emc_clk_in_1 [get_bd_pins emc_clk] [get_bd_pins pr_isolation_expanded/emc_clk]
connect_bd_net -net flash_CS_N_1 [get_bd_pins slice_ss0_Dout] [get_bd_pins pr_isolation_expanded/slice_ss0_Dout]
connect_bd_net -net flash_CS_N_tri_ctrl_1 [get_bd_pins flash_programmer_ss_t] [get_bd_pins pr_isolation_expanded/flash_programmer_ss_t]
connect_bd_net -net flash_DQ_O_1 [get_bd_pins concat_flash_dq_o_dout] [get_bd_pins pr_isolation_expanded/concat_flash_dq_o_dout]
connect_bd_net -net flash_DQ_tri_ctrl_1 [get_bd_pins concat_flash_tri_dout] [get_bd_pins pr_isolation_expanded/concat_flash_tri_dout]
connect_bd_net -net flash_clk_1 [get_bd_pins flash_programmer_sck_o] [get_bd_pins pr_isolation_expanded/flash_programmer_sck_o]
connect_bd_net -net gpio_io_i_1 [get_bd_pins logic_ddrcalib_op_Res] [get_bd_pins pr_isolation_expanded/logic_ddrcalib_op_Res]
connect_bd_net -net io0_o_1 [get_bd_pins flash_programmer_io0_o] [get_bd_pins pr_isolation_expanded/flash_programmer_io0_o]
connect_bd_net -net io0_t_1 [get_bd_pins flash_programmer_io0_t] [get_bd_pins pr_isolation_expanded/flash_programmer_io0_t]
connect_bd_net -net io1_o_1 [get_bd_pins flash_programmer_io1_o] [get_bd_pins pr_isolation_expanded/flash_programmer_io1_o]
connect_bd_net -net io1_t_1 [get_bd_pins flash_programmer_io1_t] [get_bd_pins pr_isolation_expanded/flash_programmer_io1_t]
connect_bd_net -net io2_o_1 [get_bd_pins flash_programmer_io2_o] [get_bd_pins pr_isolation_expanded/flash_programmer_io2_o]
connect_bd_net -net io2_t_1 [get_bd_pins flash_programmer_io2_t] [get_bd_pins pr_isolation_expanded/flash_programmer_io2_t]
connect_bd_net -net io3_o_1 [get_bd_pins flash_programmer_io3_o] [get_bd_pins pr_isolation_expanded/flash_programmer_io3_o]
connect_bd_net -net io3_t_1 [get_bd_pins flash_programmer_io3_t] [get_bd_pins pr_isolation_expanded/flash_programmer_io3_t]
connect_bd_net -net perst_n_in_1 [get_bd_pins perst_n] [get_bd_pins pr_isolation_expanded/perst_n]
connect_bd_net -net pr_isolation_expanded_Dout [get_bd_pins pr_isolation_expanded/slice_reset_kernel_pr_Dout] [get_bd_pins slice_reset_kernel_pr_Dout]
connect_bd_net -net pr_isolation_expanded_emc_clk_out [get_bd_pins pr_isolation_expanded/iob_static_emc_clk_out] [get_bd_pins iob_static_emc_clk_out]
connect_bd_net -net pr_isolation_expanded_init_calib_complete_out [get_bd_pins pr_isolation_expanded/iob_static_init_calib_complete_out] \
  [get_bd_pins iob_static_init_calib_complete_out]
connect_bd_net -net pr_isolation_expanded_io0_i [get_bd_pins pr_isolation_expanded/iob_static_io0_i] [get_bd_pins iob_static_io0_i]
connect_bd_net -net pr_isolation_expanded_io1_i [get_bd_pins pr_isolation_expanded/iob_static_io1_i] [get_bd_pins iob_static_io1_i]
connect_bd_net -net pr_isolation_expanded_io2_i [get_bd_pins pr_isolation_expanded/iob_static_io2_i] [get_bd_pins iob_static_io2_i]
connect_bd_net -net pr_isolation_expanded_io3_i [get_bd_pins pr_isolation_expanded/iob_static_io3_i] [get_bd_pins iob_static_io3_i]
connect_bd_net -net pr_isolation_expanded_led_0_out [get_bd_pins pr_isolation_expanded/iob_static_led_0_out] [get_bd_pins iob_static_led_0_out]
connect_bd_net -net pr_isolation_expanded_perst_n_out [get_bd_pins pr_isolation_expanded/iob_static_perst_n_out] \
  [get_bd_pins iob_static_perst_n_out] [get_bd_pins dma_pcie/sys_rst_n] [get_bd_pins base_clocking/iob_static_perst_n_out]
